# EAGLE design iotst (EAGLE 6.6.0)

## Sheet 1 of 3
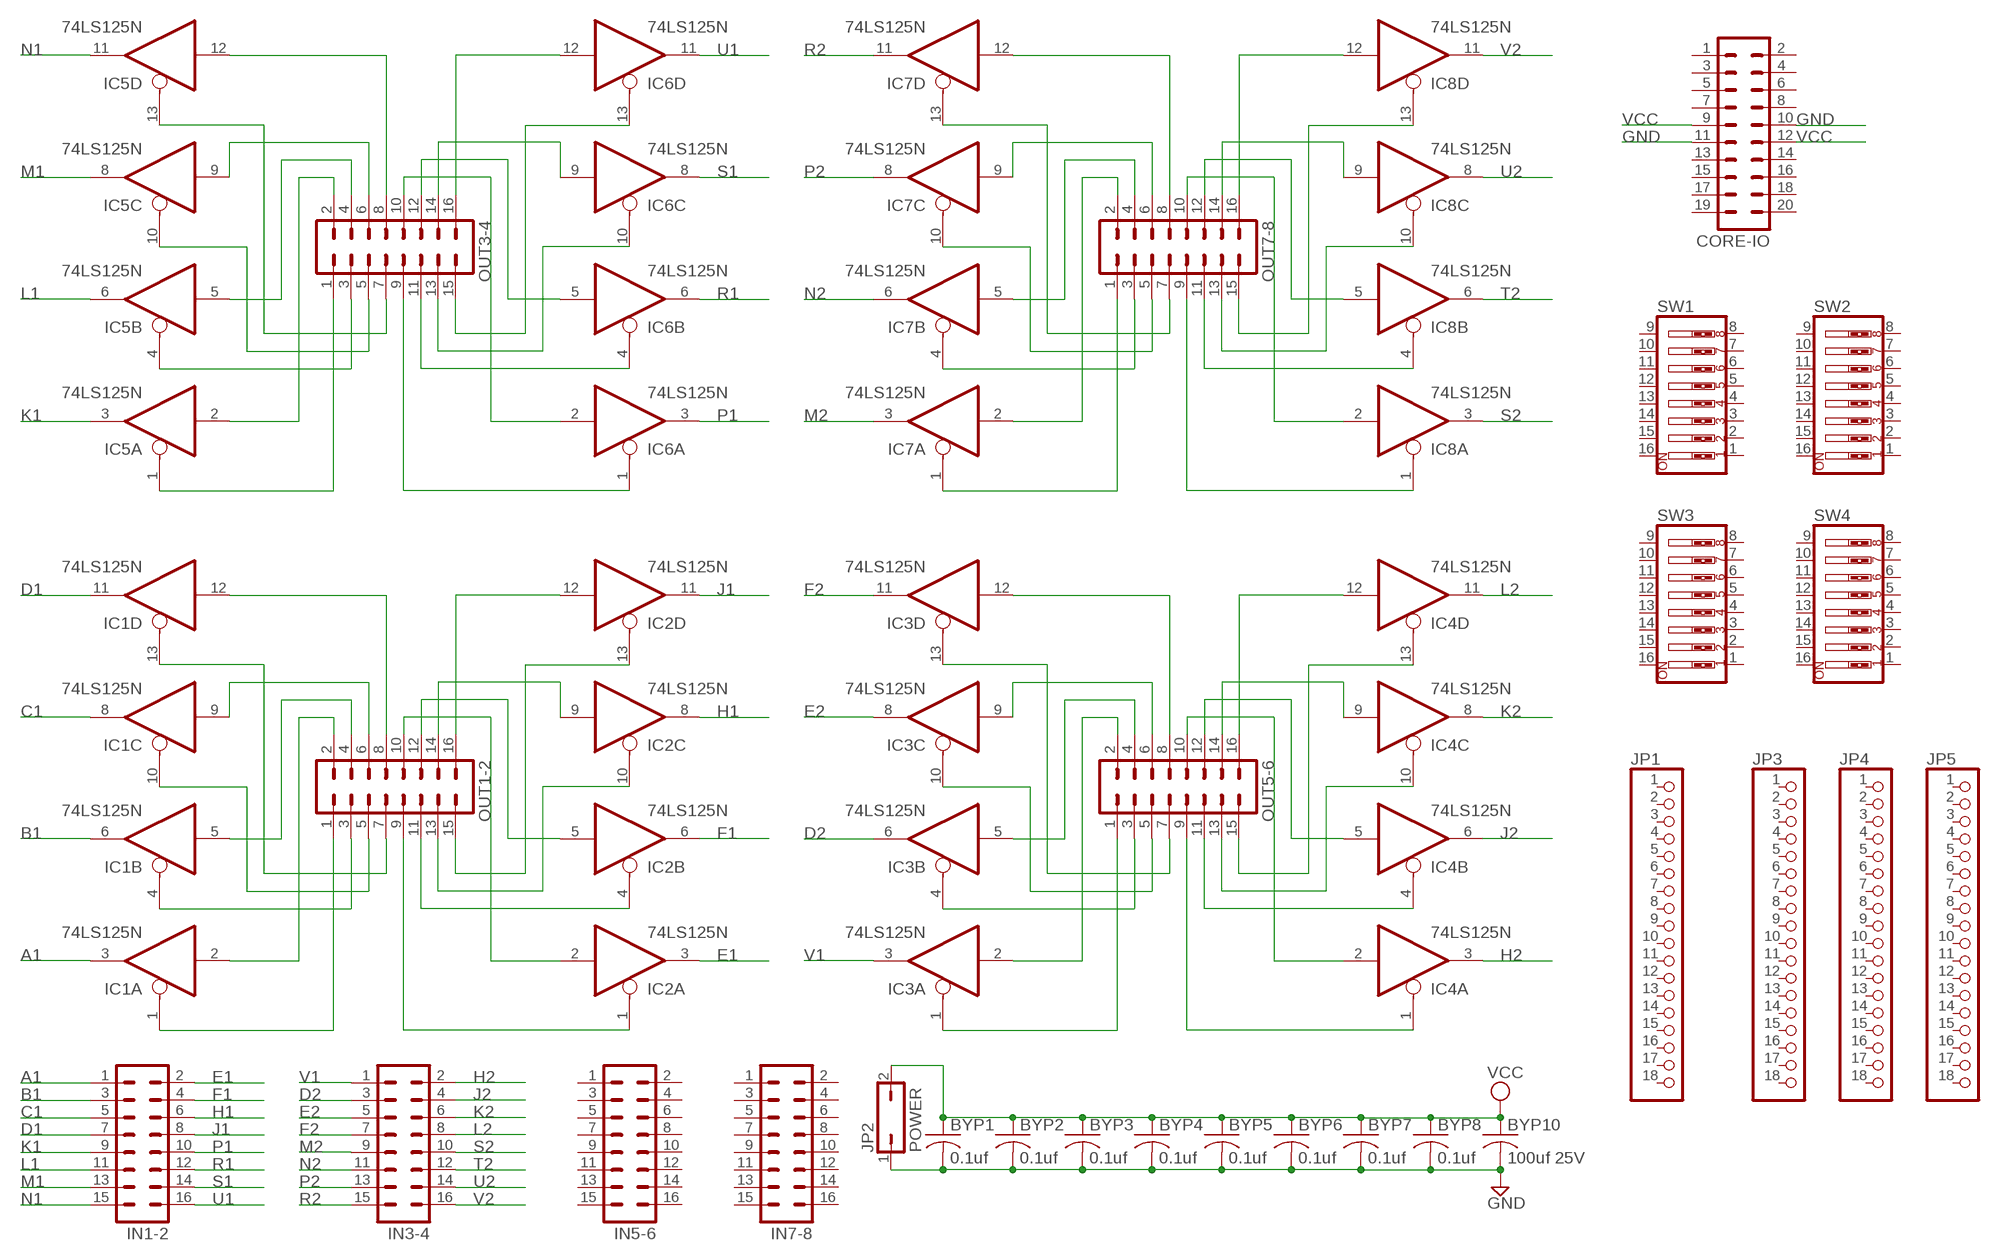
[diagram p0: schematic, sheet 1]

### Parts
BYP1  0.1uf  C-US050-025X075  [C050-025X075]
BYP2  0.1uf  C-US050-025X075  [C050-025X075]
BYP3  0.1uf  C-US050-025X075  [C050-025X075]
BYP4  0.1uf  C-US050-025X075  [C050-025X075]
BYP5  0.1uf  C-US050-025X075  [C050-025X075]
BYP6  0.1uf  C-US050-025X075  [C050-025X075]
BYP7  0.1uf  C-US050-025X075  [C050-025X075]
BYP8  0.1uf  C-US050-025X075  [C050-025X075]
BYP10  100uf 25V  C-US150-064X183  [C150-064X183]
CORE-IO  MA10-2  [MA10-2]
IC1  74LS125N  [DIL14]
IC2  74LS125N  [DIL14]
IC3  74LS125N  [DIL14]
IC4  74LS125N  [DIL14]
IC5  74LS125N  [DIL14]
IC6  74LS125N  [DIL14]
IC7  74LS125N  [DIL14]
IC8  74LS125N  [DIL14]
IN1-2  MA08-2  [MA08-2]
IN3-4  MA08-2  [MA08-2]
IN5-6  MA08-2  [MA08-2]
IN7-8  MA08-2  [MA08-2]
JP1  PINHD-1X18  [1X18]
JP2  POWER  JP1Q  [JP1]
JP3  PINHD-1X18  [1X18]
JP4  PINHD-1X18  [1X18]
JP5  PINHD-1X18  [1X18]
OUT1-2  MA08-2  [MA08-2]
OUT3-4  MA08-2  [MA08-2]
OUT5-6  MA08-2  [MA08-2]
OUT7-8  MA08-2  [MA08-2]
SW1  SW_DIP-8  [EDG-08]
SW2  SW_DIP-8  [EDG-08]
SW3  SW_DIP-8  [EDG-08]
SW4  SW_DIP-8  [EDG-08]

### Nets
A1: IC1.3(A:O) IN1-2.1 ; also sheet 3
B1: IC1.6(B:O) IN1-2.3 ; also sheet 3
C1: IC1.8(C:O) IN1-2.5 ; also sheet 3
D1: IC1.11(D:O) IN1-2.7 ; also sheet 3
D2: IC3.6(B:O) IN3-4.3 ; also sheet 3
E1: IC2.3(A:O) IN1-2.2 ; also sheet 3
E2: IC3.8(C:O) IN3-4.5 ; also sheet 3
F1: IC2.6(B:O) IN1-2.4 ; also sheet 3
F2: IC3.11(D:O) IN3-4.7 ; also sheet 3
GND [Power]: BYP1.2 BYP2.2 BYP3.2 BYP4.2 BYP5.2 BYP6.2 BYP7.2 BYP8.2 BYP10.2 CORE-IO.10 CORE-IO.11 JP2.1 ; also sheet 3
H1: IC2.8(C:O) IN1-2.6 ; also sheet 3
H2: IC4.3(A:O) IN3-4.2 ; also sheet 3
J1: IC2.11(D:O) IN1-2.8 ; also sheet 3
J2: IC4.6(B:O) IN3-4.4 ; also sheet 3
K1: IC5.3(A:O) IN1-2.9 ; also sheet 3
K2: IC4.8(C:O) IN3-4.6 ; also sheet 3
L1: IC5.6(B:O) IN1-2.11 ; also sheet 3
L2: IC4.11(D:O) IN3-4.8 ; also sheet 3
M1: IC5.8(C:O) IN1-2.13 ; also sheet 3
M2: IC7.3(A:O) IN3-4.9 ; also sheet 3
N1: IC5.11(D:O) IN1-2.15 ; also sheet 3
N2: IC7.6(B:O) IN3-4.11 ; also sheet 3
N$53: IC1.1(A:OE) OUT1-2.1
N$54: IC1.4(B:OE) OUT1-2.3
N$55: IC1.10(C:OE) OUT1-2.5
N$56: IC1.13(D:OE) OUT1-2.7
N$57: IC1.2(A:I) OUT1-2.2
N$58: IC1.5(B:I) OUT1-2.4
N$59: IC1.9(C:I) OUT1-2.6
N$60: IC1.12(D:I) OUT1-2.8
N$61: IC3.4(B:OE) OUT5-6.3
N$62: IC2.10(C:OE) OUT1-2.13
N$63: IC2.4(B:OE) OUT1-2.11
N$64: IC2.1(A:OE) OUT1-2.9
N$65: IC2.2(A:I) OUT1-2.10
N$66: IC2.5(B:I) OUT1-2.12
N$67: IC2.9(C:I) OUT1-2.14
N$68: IC2.12(D:I) OUT1-2.16
N$138: IC3.13(D:OE) OUT5-6.7
N$139: IC2.13(D:OE) OUT1-2.15
N$140: IC3.2(A:I) OUT5-6.2
N$141: IC3.5(B:I) OUT5-6.4
N$142: IC3.9(C:I) OUT5-6.6
N$143: IC3.12(D:I) OUT5-6.8
N$144: IC4.10(C:OE) OUT5-6.13
N$145: IC4.4(B:OE) OUT5-6.11
N$146: IC4.1(A:OE) OUT5-6.9
N$147: IC4.2(A:I) OUT5-6.10
N$148: IC4.9(C:I) OUT5-6.14
N$149: IC4.12(D:I) OUT5-6.16
N$150: IC3.1(A:OE) OUT5-6.1
N$151: IC3.10(C:OE) OUT5-6.5
N$152: IC4.5(B:I) OUT5-6.12
N$153: IC4.13(D:OE) OUT5-6.15
N$154: IC5.4(B:OE) OUT3-4.3
N$155: IC5.13(D:OE) OUT3-4.7
N$156: IC5.2(A:I) OUT3-4.2
N$157: IC5.5(B:I) OUT3-4.4
N$158: IC5.9(C:I) OUT3-4.6
N$159: IC5.12(D:I) OUT3-4.8
N$160: IC6.10(C:OE) OUT3-4.13
N$161: IC6.4(B:OE) OUT3-4.11
N$162: IC6.1(A:OE) OUT3-4.9
N$163: IC6.2(A:I) OUT3-4.10
N$164: IC6.9(C:I) OUT3-4.14
N$165: IC6.12(D:I) OUT3-4.16
N$166: IC5.1(A:OE) OUT3-4.1
N$167: IC5.10(C:OE) OUT3-4.5
N$168: IC6.5(B:I) OUT3-4.12
N$169: IC6.13(D:OE) OUT3-4.15
N$170: IC7.4(B:OE) OUT7-8.3
N$171: IC7.13(D:OE) OUT7-8.7
N$172: IC7.2(A:I) OUT7-8.2
N$173: IC7.5(B:I) OUT7-8.4
N$174: IC7.9(C:I) OUT7-8.6
N$175: IC7.12(D:I) OUT7-8.8
N$176: IC8.10(C:OE) OUT7-8.13
N$177: IC8.4(B:OE) OUT7-8.11
N$178: IC8.1(A:OE) OUT7-8.9
N$179: IC8.2(A:I) OUT7-8.10
N$180: IC8.9(C:I) OUT7-8.14
N$181: IC8.12(D:I) OUT7-8.16
N$182: IC7.1(A:OE) OUT7-8.1
N$183: IC7.10(C:OE) OUT7-8.5
N$184: IC8.5(B:I) OUT7-8.12
N$185: IC8.13(D:OE) OUT7-8.15
P1: IC6.3(A:O) IN1-2.10 ; also sheet 3
P2: IC7.8(C:O) IN3-4.13 ; also sheet 3
R1: IC6.6(B:O) IN1-2.12 ; also sheet 3
R2: IC7.11(D:O) IN3-4.15 ; also sheet 3
S1: IC6.8(C:O) IN1-2.14 ; also sheet 3
S2: IC8.3(A:O) IN3-4.10 ; also sheet 3
T2: IC8.6(B:O) IN3-4.12 ; also sheet 3
U1: IC6.11(D:O) IN1-2.16 ; also sheet 3
U2: IC8.8(C:O) IN3-4.14 ; also sheet 3
V1: IC3.3(A:O) IN3-4.1 ; also sheet 3
V2: IC8.11(D:O) IN3-4.16 ; also sheet 3
VCC [Power]: BYP1.1 BYP2.1 BYP3.1 BYP4.1 BYP5.1 BYP6.1 BYP7.1 BYP8.1 BYP10.1 CORE-IO.9 CORE-IO.12 JP2.2 ; also sheet 3
Unconnected: CORE-IO.1 CORE-IO.2 CORE-IO.3 CORE-IO.4 CORE-IO.5 CORE-IO.6 CORE-IO.7 CORE-IO.8 CORE-IO.13 CORE-IO.14 CORE-IO.15 CORE-IO.16 CORE-IO.17 CORE-IO.18 CORE-IO.19 CORE-IO.20 IN5-6.1 IN5-6.2 IN5-6.3 IN5-6.4 IN5-6.5 IN5-6.6 IN5-6.7 IN5-6.8 IN5-6.9 IN5-6.10 IN5-6.11 IN5-6.12 IN5-6.13 IN5-6.14 IN5-6.15 IN5-6.16 IN7-8.1 IN7-8.2 IN7-8.3 IN7-8.4 IN7-8.5 IN7-8.6 IN7-8.7 IN7-8.8 IN7-8.9 IN7-8.10 IN7-8.11 IN7-8.12 IN7-8.13 IN7-8.14 IN7-8.15 IN7-8.16 JP1.1 JP1.2 JP1.3 JP1.4 JP1.5 JP1.6 JP1.7 JP1.8 JP1.9 JP1.10 JP1.11 JP1.12 JP1.13 JP1.14 JP1.15 JP1.16 JP1.17 JP1.18 JP3.1 JP3.2 JP3.3 JP3.4 JP3.5 JP3.6 JP3.7 JP3.8 JP3.9 JP3.10 JP3.11 JP3.12 JP3.13 JP3.14 JP3.15 JP3.16 JP3.17 JP3.18 JP4.1 JP4.2 JP4.3 JP4.4 JP4.5 JP4.6 JP4.7 JP4.8 JP4.9 JP4.10 JP4.11 JP4.12 JP4.13 JP4.14 JP4.15 JP4.16 JP4.17 JP4.18 JP5.1 JP5.2 JP5.3 JP5.4 JP5.5 JP5.6 JP5.7 JP5.8 JP5.9 JP5.10 JP5.11 JP5.12 JP5.13 JP5.14 JP5.15 JP5.16 JP5.17 JP5.18 SW1.1 SW1.2 SW1.3 SW1.4 SW1.5 SW1.6 SW1.7 SW1.8 SW1.9 SW1.10 SW1.11 SW1.12 SW1.13 SW1.14 SW1.15 SW1.16 SW2.1 SW2.2 SW2.3 SW2.4 SW2.5 SW2.6 SW2.7 SW2.8 SW2.9 SW2.10 SW2.11 SW2.12 SW2.13 SW2.14 SW2.15 SW2.16 SW3.1 SW3.2 SW3.3 SW3.4 SW3.5 SW3.6 SW3.7 SW3.8 SW3.9 SW3.10 SW3.11 SW3.12 SW3.13 SW3.14 SW3.15 SW3.16 SW4.1 SW4.2 SW4.3 SW4.4 SW4.5 SW4.6 SW4.7 SW4.8 SW4.9 SW4.10 SW4.11 SW4.12 SW4.13 SW4.14 SW4.15 SW4.16

## Sheet 2 of 3
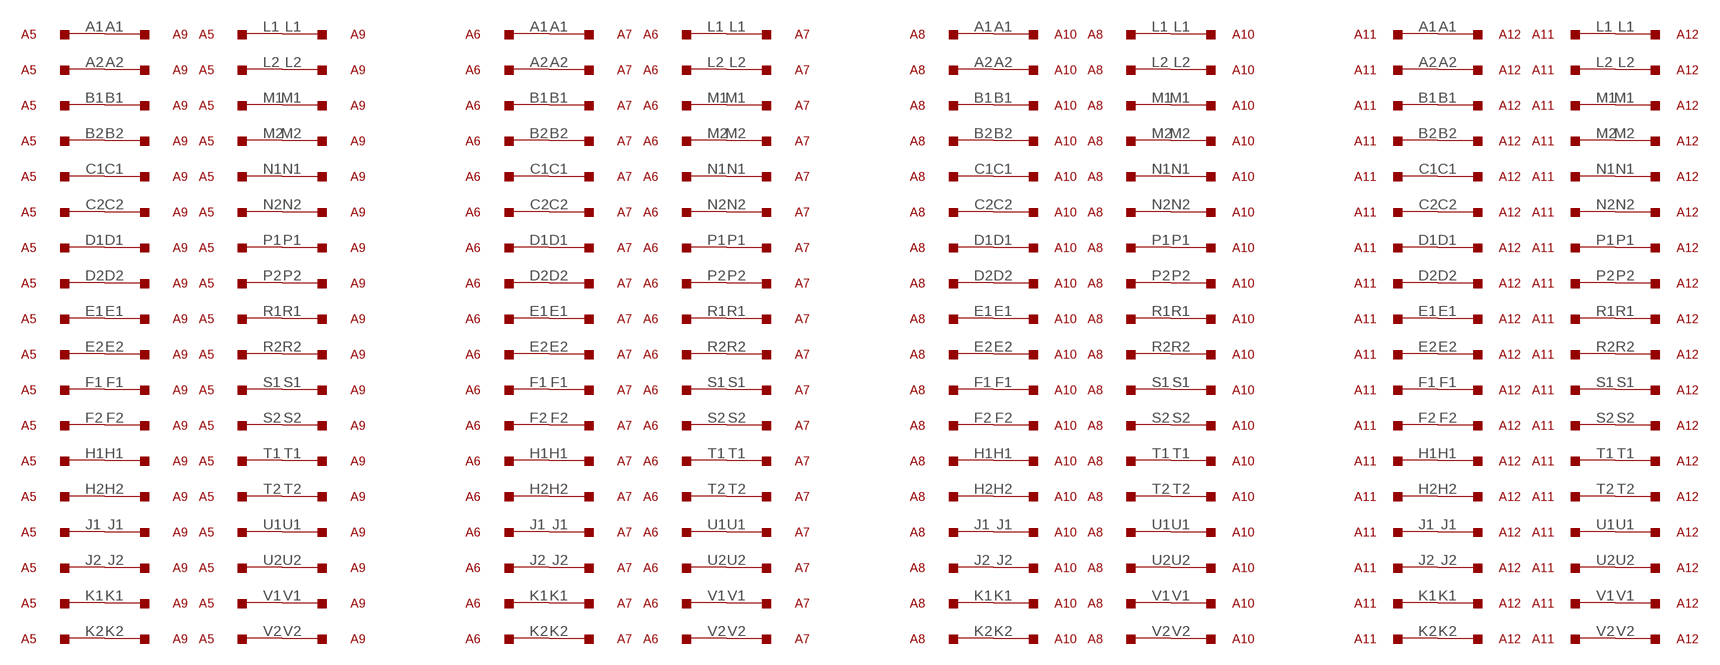
[diagram p1: schematic, sheet 2]

### Parts
A5  M916  [H807]
A6  M916  [H807]
A7  M916  [H807]
A8  M916  [H807]
A9  M916  [H807]
A10  M916  [H807]
A11  M916  [H807]
A12  M916  [H807]

### Nets
N$26: A5.L1 A9.L1
N$33: A5.L2 A9.L2
N$34: A5.M1 A9.M1
N$35: A5.M2 A9.M2
N$36: A5.N1 A9.N1
N$49: A5.N2 A9.N2
N$50: A5.P1 A9.P1
N$51: A5.P2 A9.P2
N$52: A5.R1 A9.R1
N$69: A5.R2 A9.R2
N$70: A5.S1 A9.S1
N$71: A5.S2 A9.S2
N$72: A5.T1 A9.T1
N$73: A5.T2 A9.T2
N$74: A5.U1 A9.U1
N$75: A5.U2 A9.U2
N$76: A5.V1 A9.V1
N$81: A5.V2 A9.V2
N$82: A5.A1 A9.A1
N$83: A5.A2 A9.A2
N$84: A5.B1 A9.B1
N$85: A5.B2 A9.B2
N$86: A5.C1 A9.C1
N$87: A5.C2 A9.C2
N$88: A5.D1 A9.D1
N$89: A5.D2 A9.D2
N$90: A5.E1 A9.E1
N$91: A5.E2 A9.E2
N$92: A5.F1 A9.F1
N$93: A5.F2 A9.F2
N$95: A5.H1 A9.H1
N$96: A5.H2 A9.H2
N$97: A5.J1 A9.J1
N$98: A5.J2 A9.J2
N$99: A5.K1 A9.K1
N$100: A5.K2 A9.K2
N$113: A6.L1 A7.L1
N$114: A6.L2 A7.L2
N$115: A6.M1 A7.M1
N$116: A6.M2 A7.M2
N$117: A6.N1 A7.N1
N$118: A6.N2 A7.N2
N$119: A6.P1 A7.P1
N$120: A6.P2 A7.P2
N$121: A6.R1 A7.R1
N$122: A6.R2 A7.R2
N$123: A6.S1 A7.S1
N$137: A6.S2 A7.S2
N$186: A6.T1 A7.T1
N$187: A6.T2 A7.T2
N$188: A6.U1 A7.U1
N$189: A6.U2 A7.U2
N$190: A6.V1 A7.V1
N$191: A6.V2 A7.V2
N$192: A6.A1 A7.A1
N$193: A6.A2 A7.A2
N$194: A6.B1 A7.B1
N$195: A6.B2 A7.B2
N$196: A6.C1 A7.C1
N$197: A6.C2 A7.C2
N$198: A6.D1 A7.D1
N$199: A6.D2 A7.D2
N$200: A6.E1 A7.E1
N$201: A6.E2 A7.E2
N$202: A6.F1 A7.F1
N$203: A6.F2 A7.F2
N$204: A6.H1 A7.H1
N$205: A6.H2 A7.H2
N$206: A6.J1 A7.J1
N$207: A6.J2 A7.J2
N$208: A6.K1 A7.K1
N$209: A6.K2 A7.K2
N$210: A8.L1 A10.L1
N$211: A8.L2 A10.L2
N$212: A8.M1 A10.M1
N$213: A8.M2 A10.M2
N$214: A8.N1 A10.N1
N$215: A8.N2 A10.N2
N$216: A8.P1 A10.P1
N$217: A8.P2 A10.P2
N$218: A8.R1 A10.R1
N$219: A8.R2 A10.R2
N$220: A8.S1 A10.S1
N$221: A8.S2 A10.S2
N$222: A8.T1 A10.T1
N$223: A8.T2 A10.T2
N$224: A8.U1 A10.U1
N$225: A8.U2 A10.U2
N$226: A8.V1 A10.V1
N$227: A8.V2 A10.V2
N$228: A8.A1 A10.A1
N$229: A8.A2 A10.A2
N$230: A8.B1 A10.B1
N$231: A8.B2 A10.B2
N$232: A8.C1 A10.C1
N$233: A8.C2 A10.C2
N$234: A8.D1 A10.D1
N$235: A8.D2 A10.D2
N$236: A8.E1 A10.E1
N$237: A8.E2 A10.E2
N$238: A8.F1 A10.F1
N$239: A8.F2 A10.F2
N$240: A8.H1 A10.H1
N$241: A8.H2 A10.H2
N$242: A8.J1 A10.J1
N$243: A8.J2 A10.J2
N$244: A8.K1 A10.K1
N$245: A8.K2 A10.K2
N$246: A11.L1 A12.L1
N$247: A11.L2 A12.L2
N$248: A11.M1 A12.M1
N$249: A11.M2 A12.M2
N$250: A11.N1 A12.N1
N$251: A11.N2 A12.N2
N$252: A11.P1 A12.P1
N$253: A11.P2 A12.P2
N$254: A11.R1 A12.R1
N$255: A11.R2 A12.R2
N$256: A11.S1 A12.S1
N$257: A11.S2 A12.S2
N$258: A11.T1 A12.T1
N$259: A11.T2 A12.T2
N$260: A11.U1 A12.U1
N$261: A11.U2 A12.U2
N$262: A11.V1 A12.V1
N$263: A11.V2 A12.V2
N$264: A11.A1 A12.A1
N$265: A11.A2 A12.A2
N$266: A11.B1 A12.B1
N$267: A11.B2 A12.B2
N$268: A11.C1 A12.C1
N$269: A11.C2 A12.C2
N$270: A11.D1 A12.D1
N$271: A11.D2 A12.D2
N$272: A11.E1 A12.E1
N$273: A11.E2 A12.E2
N$274: A11.F1 A12.F1
N$275: A11.F2 A12.F2
N$276: A11.H1 A12.H1
N$277: A11.H2 A12.H2
N$278: A11.J1 A12.J1
N$279: A11.J2 A12.J2
N$280: A11.K1 A12.K1
N$281: A11.K2 A12.K2

## Sheet 3 of 3
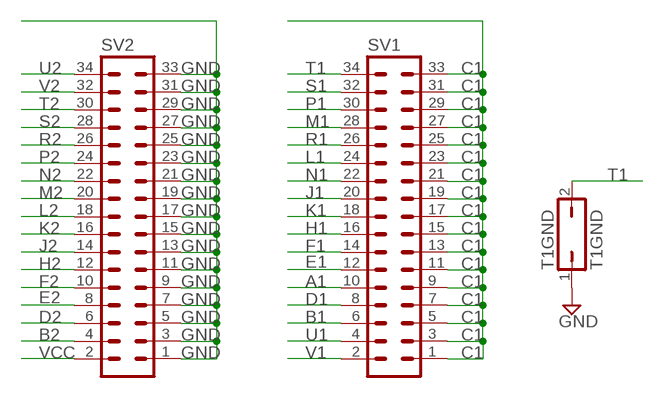
[diagram p2: schematic, sheet 3]

### Parts
SV1  MA17-2  [MA17-2]
SV2  MA17-2  [MA17-2]
T1GND  T1GND  JP1Q  [JP1]

### Nets
A1: SV1.10 ; also sheet 1
B1: SV1.6 ; also sheet 1
B2: SV2.4
C1: SV1.1 SV1.3 SV1.5 SV1.7 SV1.9 SV1.11 SV1.13 SV1.15 SV1.17 SV1.19 SV1.21 SV1.23 SV1.25 SV1.27 SV1.29 SV1.31 SV1.33 ; also sheet 1
D1: SV1.8 ; also sheet 1
D2: SV2.6 ; also sheet 1
E1: SV1.12 ; also sheet 1
E2: SV2.8 ; also sheet 1
F1: SV1.14 ; also sheet 1
F2: SV2.10 ; also sheet 1
GND [Power]: SV2.1 SV2.3 SV2.5 SV2.7 SV2.9 SV2.11 SV2.13 SV2.15 SV2.17 SV2.19 SV2.21 SV2.23 SV2.25 SV2.27 SV2.29 SV2.31 SV2.33 T1GND.1 ; also sheet 1
H1: SV1.16 ; also sheet 1
H2: SV2.12 ; also sheet 1
J1: SV1.20 ; also sheet 1
J2: SV2.14 ; also sheet 1
K1: SV1.18 ; also sheet 1
K2: SV2.16 ; also sheet 1
L1: SV1.24 ; also sheet 1
L2: SV2.18 ; also sheet 1
M1: SV1.28 ; also sheet 1
M2: SV2.20 ; also sheet 1
N1: SV1.22 ; also sheet 1
N2: SV2.22 ; also sheet 1
P1: SV1.30 ; also sheet 1
P2: SV2.24 ; also sheet 1
R1: SV1.26 ; also sheet 1
R2: SV2.26 ; also sheet 1
S1: SV1.32 ; also sheet 1
S2: SV2.28 ; also sheet 1
T1: SV1.34 T1GND.2
T2: SV2.30 ; also sheet 1
U1: SV1.4 ; also sheet 1
U2: SV2.34 ; also sheet 1
V1: SV1.2 ; also sheet 1
V2: SV2.32 ; also sheet 1
VCC [Power]: SV2.2 ; also sheet 1

## Power pins joined to a net without a drawn wire
GND: IC1.7(P:GND) IC2.7(P:GND) IC3.7(P:GND) IC4.7(P:GND) IC5.7(P:GND) IC6.7(P:GND) IC7.7(P:GND) IC8.7(P:GND)
VCC: IC1.14(P:VCC) IC2.14(P:VCC) IC3.14(P:VCC) IC4.14(P:VCC) IC5.14(P:VCC) IC6.14(P:VCC) IC7.14(P:VCC) IC8.14(P:VCC)

## Library data of the parts
A5-A12 = dec-m:M916: Simple 36 pin connector/wire cable
BYP1-BYP8 BYP10 = rcl:C-US: CAPACITOR, American symbol
CORE-IO = con-lstb:MA10-2: PIN HEADER; OC_FARNELL: unknown; OC_NEWARK: unknown
IC1-IC8 = 74xx-us:74*125: Quad bus BUFFER, 3-state
IN1-2 IN3-4 IN5-6 IN7-8 OUT1-2 OUT3-4 OUT5-6 OUT7-8 = con-lstb:MA08-2: PIN HEADER; OC_FARNELL: unknown; OC_NEWARK: unknown
JP1 JP3-JP5 = pinhead:PINHD-1X18: PIN HEADER
JP2 T1GND = jumper:JP1Q: JUMPER
SV1 SV2 = con-lstb:MA17-2: PIN HEADER; OC_FARNELL: unknown; OC_NEWARK: unknown
SW1-SW4 = special:SW_DIP-8: DIP SWITCH

## Net classes
1 Power: width 0.508 mm, drill 0.254 mm, clearance 0.254 mm

## Board
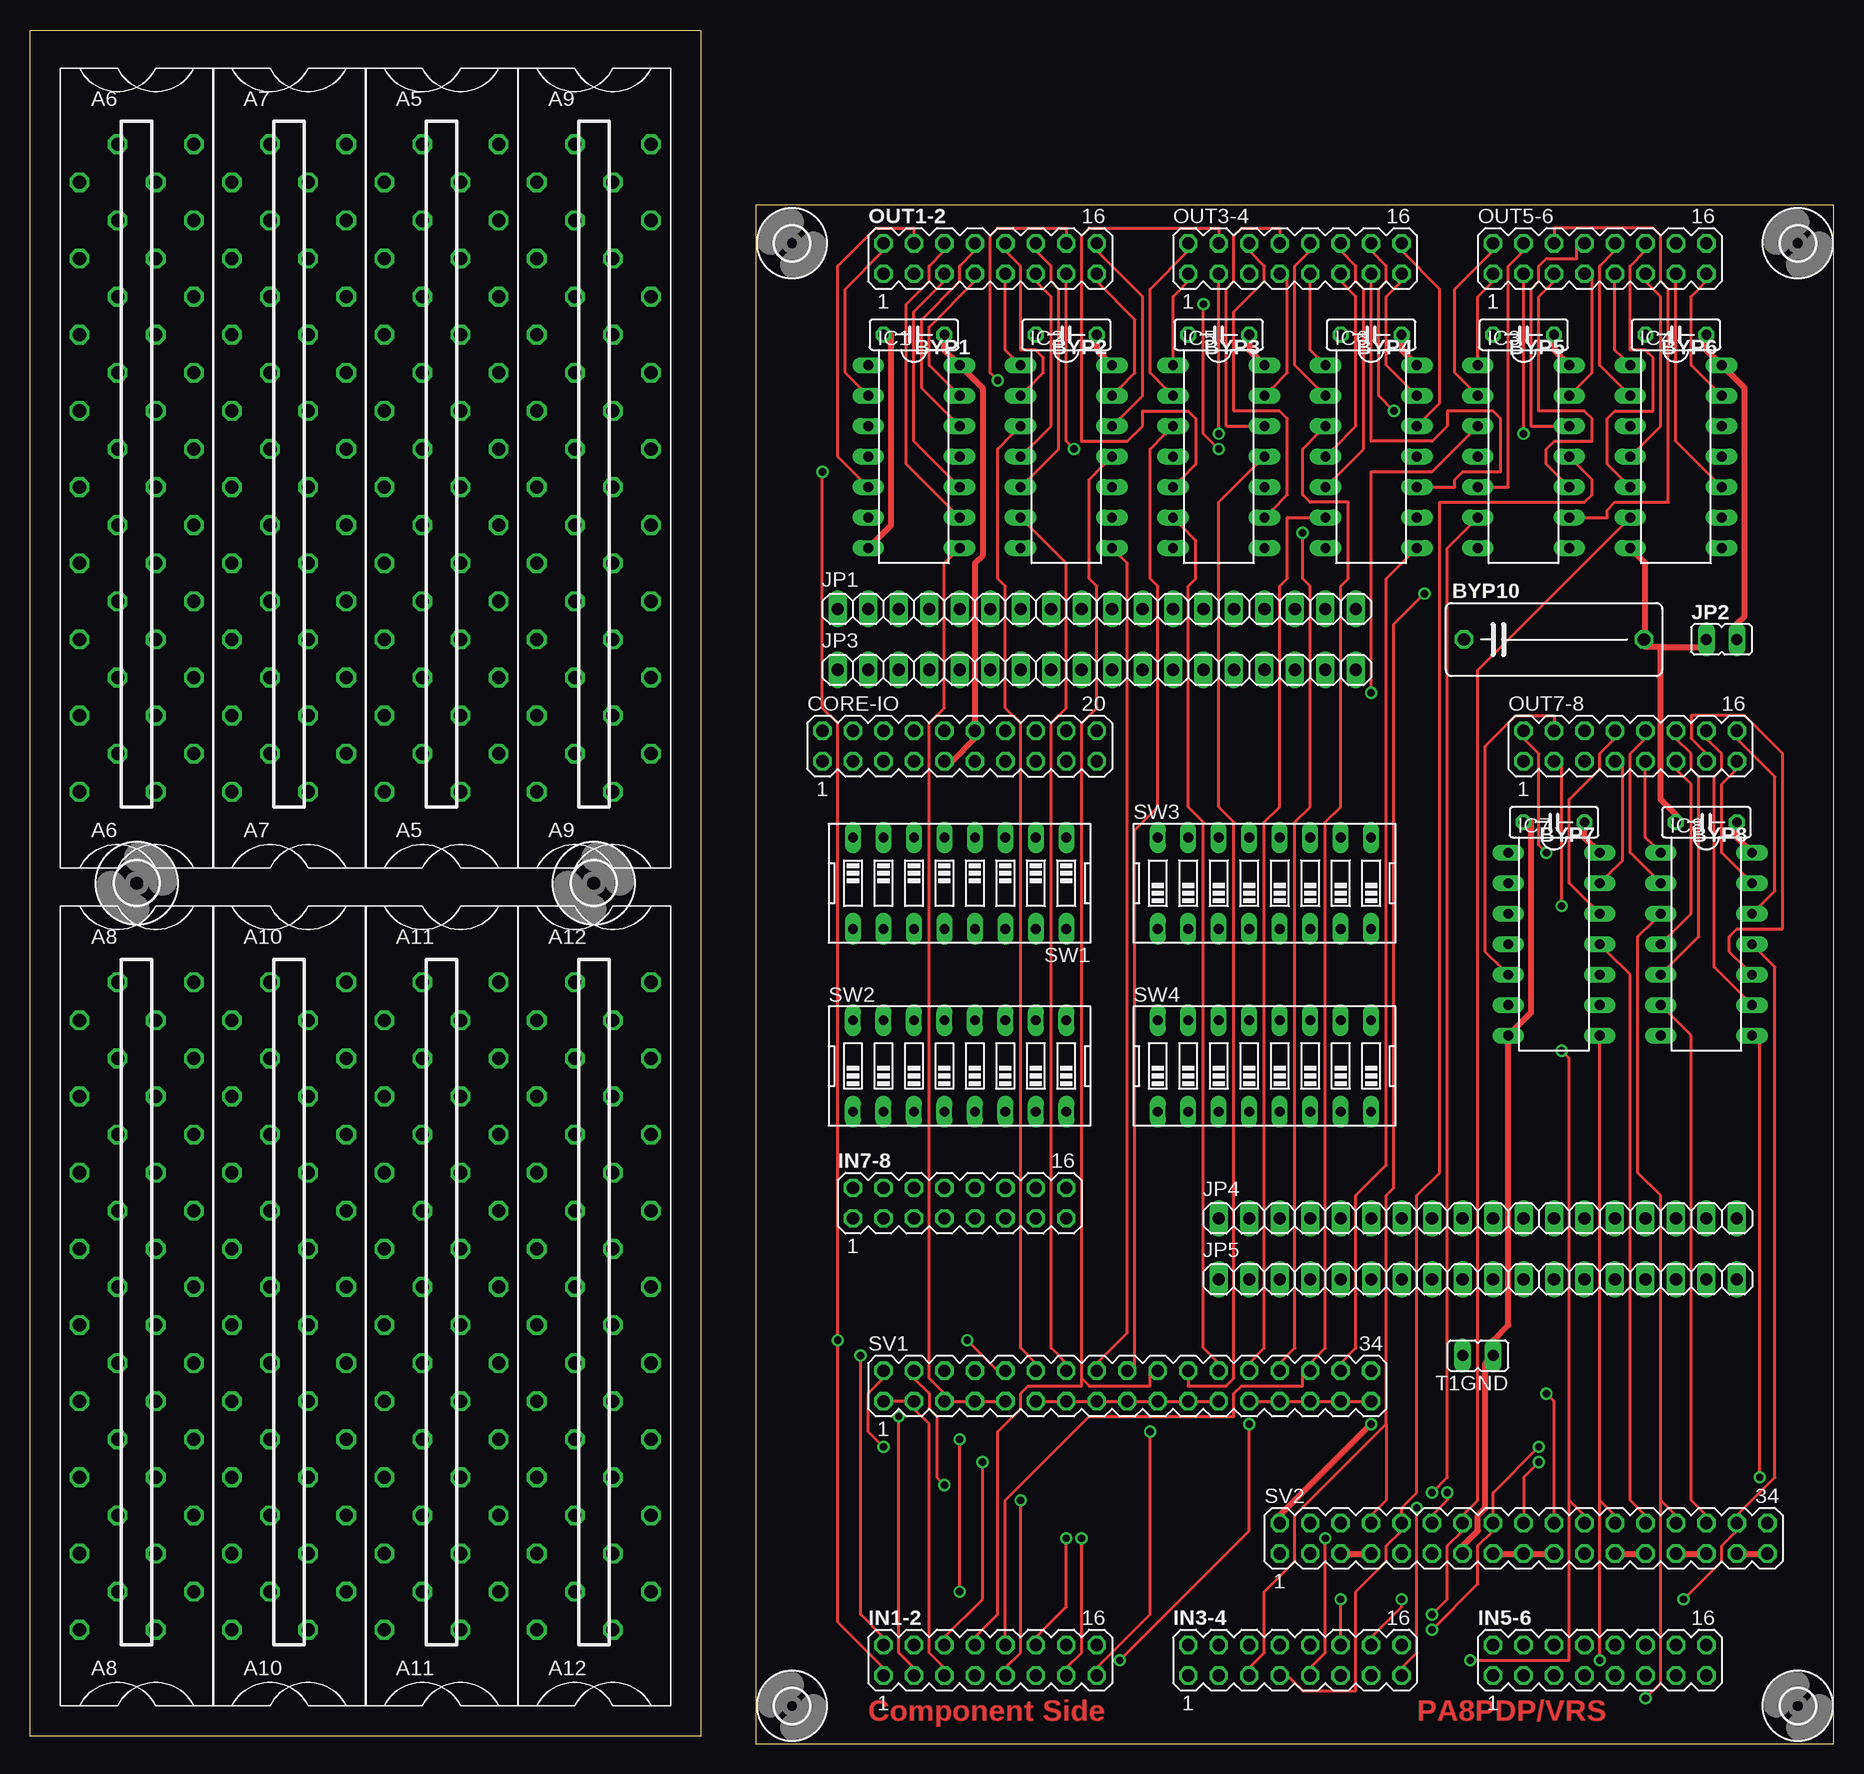
[diagram p3: board, top side]
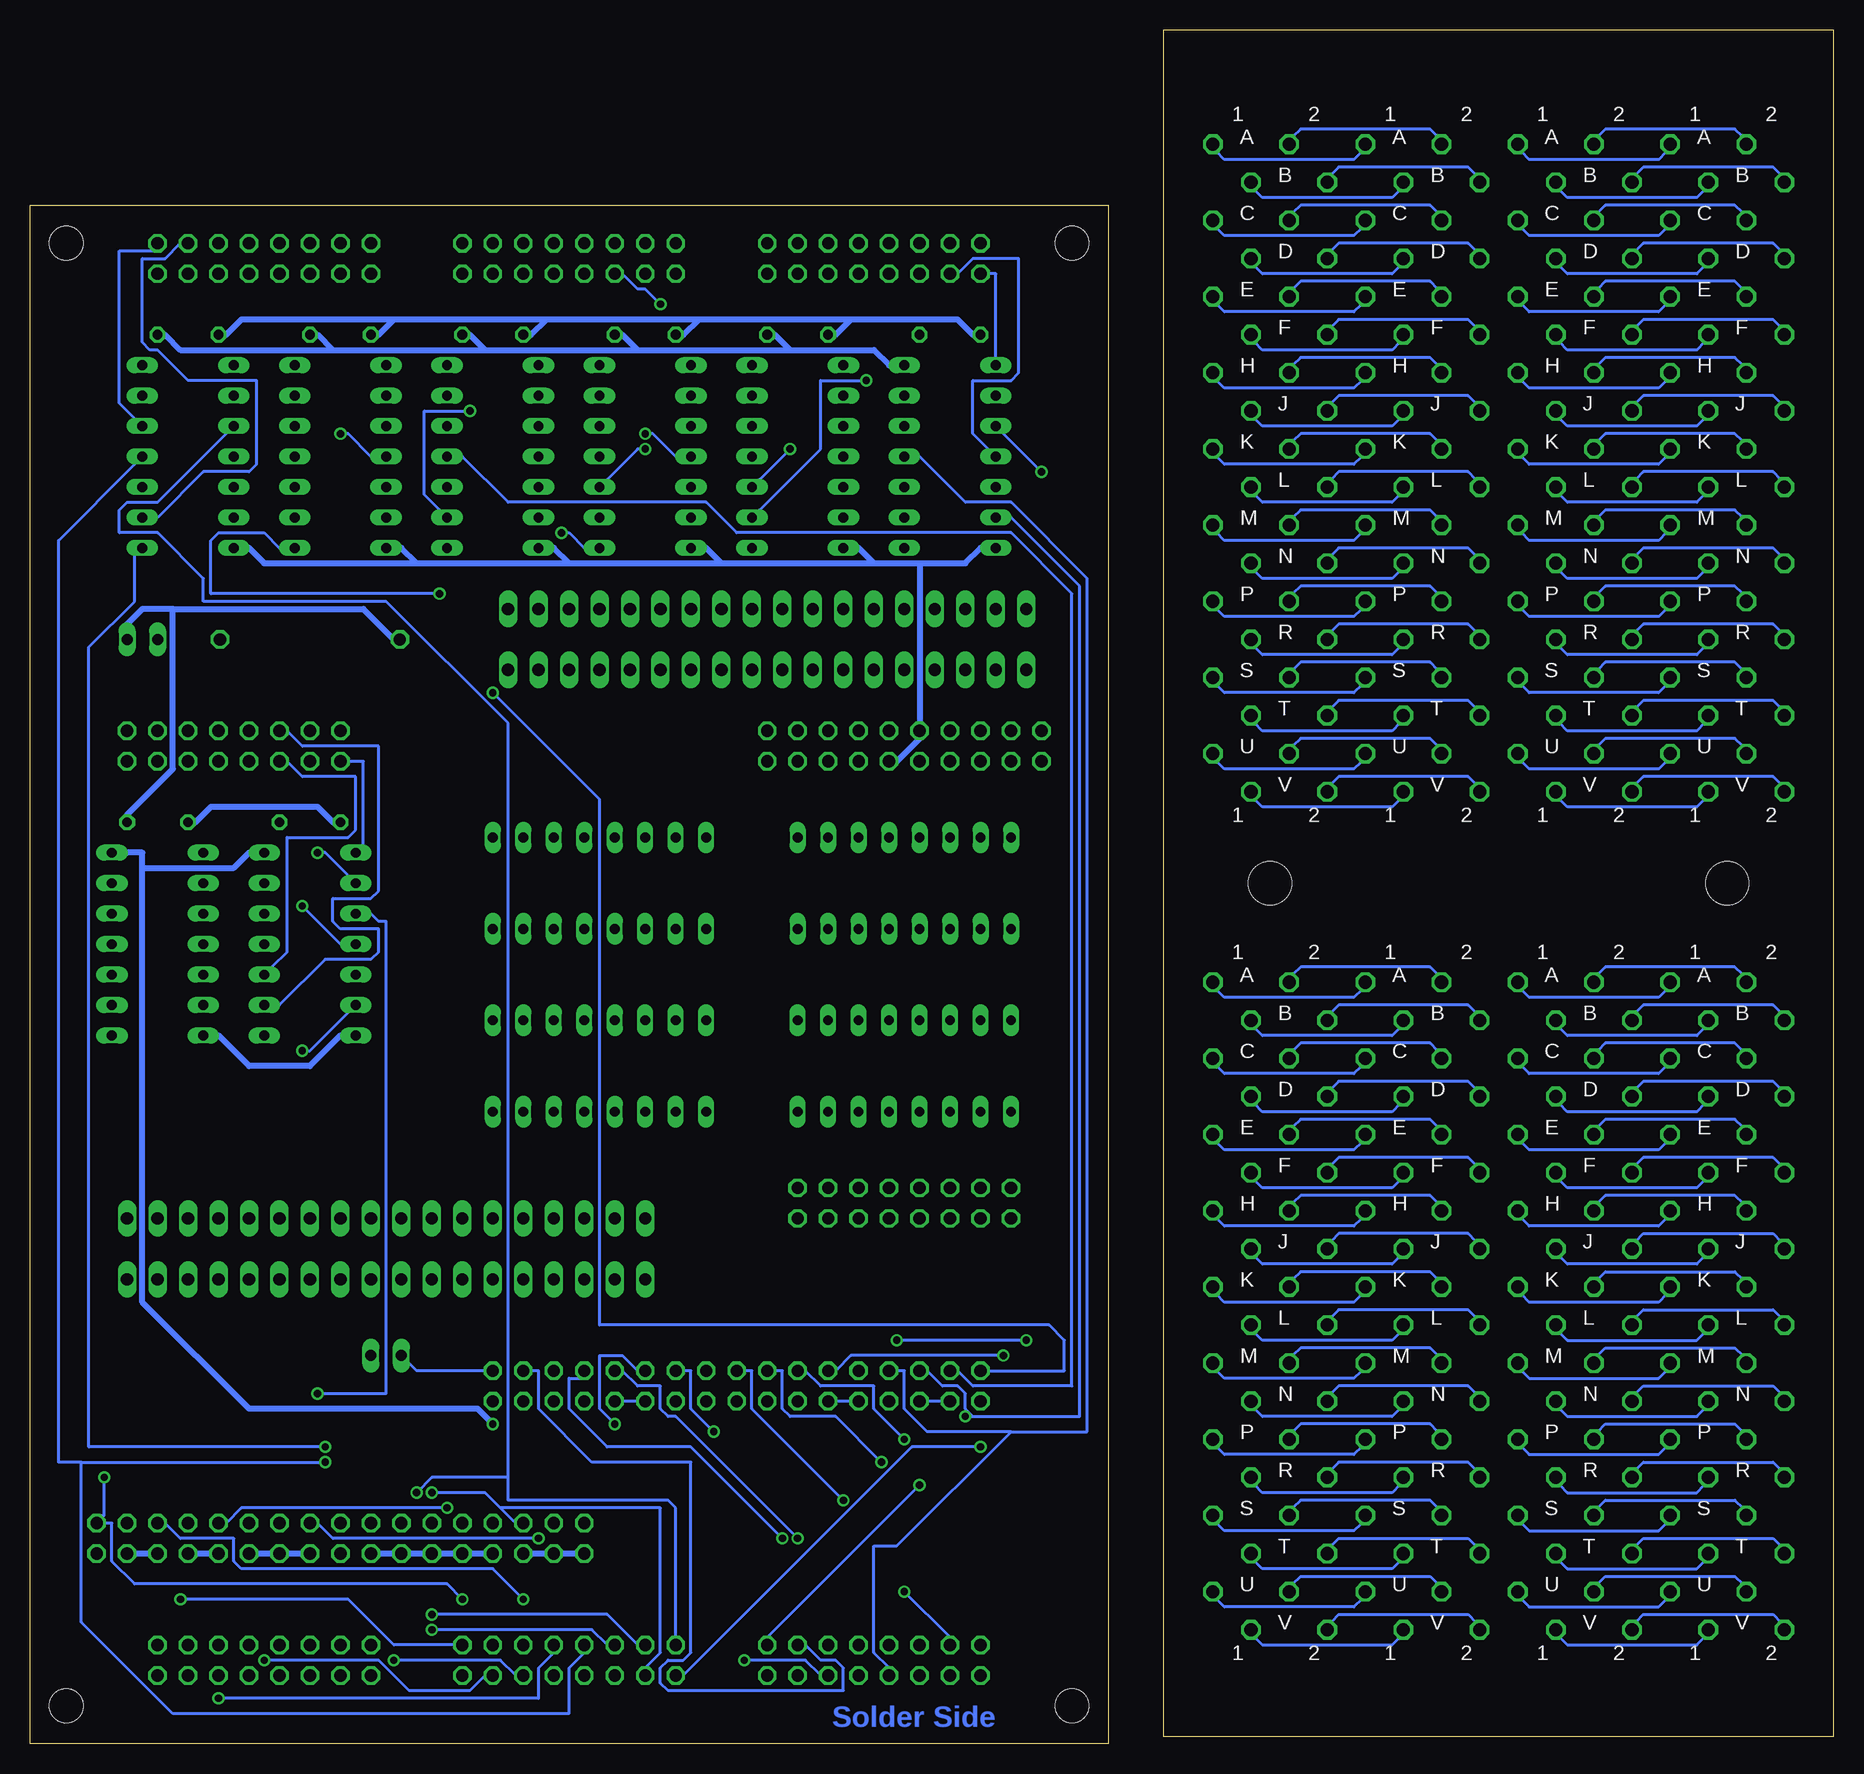
[diagram p4: board, bottom side, seen from below]

Size 150.33 x 142.86 mm. Coordinates in mm from the lower left corner, seen from the top.
Outline: 60.49,128.25 60.49,0 150.33,0 150.33,128.25 60.49,128.25
Outline: 55.88,0.62 0,0.62 0,142.86 55.88,142.86 55.88,0.62
Copper layers (1*16): Top 0.035mm / dielectric 1.5mm / Bottom 0.035mm
Design rules "olimex10mil": minimum track width 10mil, minimum drill 24mil, track to track 10mil, track to pad 10mil, pad to pad 10mil, via to via 10mil, smd to smd 10mil, copper to edge 40mil, drill to drill 10mil, minimum pad ring 10mil, minimum via ring 8mil, stop-mask expansion 0mil, vias tented up to drill 0mil, thermal gap 10mil

### Footprints (pad centres in the part's own frame; a part is rotated, then mirrored left to right if it is on the bottom)
H807 = drill 1.092 octagon: A1 4.763,28.575; A2 -1.587,28.575; B1 1.587,25.4; B2 -4.763,25.4; C1 4.763,22.225; C2 -1.587,22.225; D1 1.587,19.05; D2 -4.763,19.05; E1 4.763,15.875; E2 -1.587,15.875; F1 1.587,12.7; F2 -4.763,12.7; H1 4.763,9.525; H2 -1.587,9.525; J1 1.587,6.35; J2 -4.763,6.35; K1 4.763,3.175; K2 -1.587,3.175; L1 1.587,0; L2 -4.763,0; M1 4.763,-3.175; M2 -1.587,-3.175; N1 1.587,-6.35; N2 -4.763,-6.35; P1 4.763,-9.525; P2 -1.587,-9.525; R1 1.587,-12.7; R2 -4.763,-12.7; S1 4.763,-15.875; S2 -1.587,-15.875; T1 1.587,-19.05; T2 -4.763,-19.05; U1 4.763,-22.225; U2 -1.587,-22.225; V1 1.587,-25.4; V2 -4.763,-25.4
C050-025X075 = drill 0.813 octagon: 1 -2.54,0; 2 2.54,0
C150-064X183 = drill 1.016 octagon: 1 -7.493,0; 2 7.493,0
MA10-2 = drill 1.016 octagon: 1 -11.43,-1.27; 2 -11.43,1.27; 3 -8.89,-1.27; 4 -8.89,1.27; 5 -6.35,-1.27; 6 -6.35,1.27; 7 -3.81,-1.27; 8 -3.81,1.27; 9 -1.27,-1.27; 10 -1.27,1.27; 11 1.27,-1.27; 12 1.27,1.27; 13 3.81,-1.27; 14 3.81,1.27; 15 6.35,-1.27; 16 6.35,1.27; 17 8.89,-1.27; 18 8.89,1.27; 19 11.43,-1.27; 20 11.43,1.27
DIL14 = drill 0.813 long: 1 -7.62,-3.81; 2 -5.08,-3.81; 3 -2.54,-3.81; 4 0,-3.81; 5 2.54,-3.81; 6 5.08,-3.81; 7 7.62,-3.81; 8 7.62,3.81; 9 5.08,3.81; 10 2.54,3.81; 11 0,3.81; 12 -2.54,3.81; 13 -5.08,3.81; 14 -7.62,3.81
MA08-2 = drill 1.016 octagon: 1 -8.89,-1.27; 2 -8.89,1.27; 3 -6.35,-1.27; 4 -6.35,1.27; 5 -3.81,-1.27; 6 -3.81,1.27; 7 -1.27,-1.27; 8 -1.27,1.27; 9 1.27,-1.27; 10 1.27,1.27; 11 3.81,-1.27; 12 3.81,1.27; 13 6.35,-1.27; 14 6.35,1.27; 15 8.89,-1.27; 16 8.89,1.27
1X18 = drill 1.016 long: 1 -21.59,0; 2 -19.05,0; 3 -16.51,0; 4 -13.97,0; 5 -11.43,0; 6 -8.89,0; 7 -6.35,0; 8 -3.81,0; 9 -1.27,0; 10 1.27,0; 11 3.81,0; 12 6.35,0; 13 8.89,0; 14 11.43,0; 15 13.97,0; 16 16.51,0; 17 19.05,0; 18 21.59,0
JP1 = drill 0.914 long: 1 0,-1.27; 2 0,1.27
MA17-2 = drill 1.016 octagon: 1 -20.32,-1.27; 2 -20.32,1.27; 3 -17.78,-1.27; 4 -17.78,1.27; 5 -15.24,-1.27; 6 -15.24,1.27; 7 -12.7,-1.27; 8 -12.7,1.27; 9 -10.16,-1.27; 10 -10.16,1.27; 11 -7.62,-1.27; 12 -7.62,1.27; 13 -5.08,-1.27; 14 -5.08,1.27; 15 -2.54,-1.27; 16 -2.54,1.27; 17 0,-1.27; 18 0,1.27; 19 2.54,-1.27; 20 2.54,1.27; 21 5.08,-1.27; 22 5.08,1.27; 23 7.62,-1.27; 24 7.62,1.27; 25 10.16,-1.27; 26 10.16,1.27; 27 12.7,-1.27; 28 12.7,1.27; 29 15.24,-1.27; 30 15.24,1.27; 31 17.78,-1.27; 32 17.78,1.27; 33 20.32,-1.27; 34 20.32,1.27
EDG-08 = drill 0.813 long: 1 -8.89,-3.81; 2 -6.35,-3.81; 3 -3.81,-3.81; 4 -1.27,-3.81; 5 1.27,-3.81; 6 3.81,-3.81; 7 6.35,-3.81; 8 8.89,-3.81; 9 8.89,3.81; 10 6.35,3.81; 11 3.81,3.81; 12 1.27,3.81; 13 -1.27,3.81; 14 -3.81,3.81; 15 -6.35,3.81; 16 -8.89,3.81
2,8 = hole 2.8: 0,0
3,6 = hole 3.6: 0,0

### Placement (x,y rotation side)
A5  34.29,104.76 0 top
A6  8.89,104.76 0 top
A7  21.59,104.76 0 top
A8  8.89,34.91 0 top
A9  46.99,104.76 0 top
A10  21.59,34.91 0 top
A11  34.29,34.91 0 top
A12  46.99,34.91 0 top
BYP1  73.66,117.46 180 top
BYP2  86.36,117.46 180 top
BYP3  99.06,117.46 180 top
BYP4  111.76,117.46 180 top
BYP5  124.46,117.46 180 top
BYP6  137.16,117.46 180 top
BYP7  127,76.82 180 top
BYP8  139.7,76.82 180 top
BYP10  127,92.06 0 top
CORE-IO  77.47,83.17 0 top
IC1  73.66,107.3 270 top
IC2  86.36,107.3 270 top
IC3  124.46,107.3 270 top
IC4  137.16,107.3 270 top
IC5  99.06,107.3 270 top
IC6  111.76,107.3 270 top
IC7  127,66.66 270 top
IC8  139.7,66.66 270 top
IN1-2  80.01,6.97 0 top
IN3-4  105.41,6.97 0 top
IN5-6  130.81,6.97 0 top
IN7-8  77.47,45.07 0 top
JP1  88.9,94.6 0 top
JP2  140.97,92.06 270 top
JP3  88.9,89.52 0 top
JP4  120.65,43.8 0 top
JP5  120.65,38.72 0 top
OUT1-2  80.01,123.81 0 top
OUT3-4  105.41,123.81 0 top
OUT5-6  130.81,123.81 0 top
OUT7-8  133.35,83.17 0 top
SV1  91.44,29.83 0 top
SV2  124.46,17.13 0 top
SW1  77.47,71.74 180 top
SW2  77.47,56.5 0 top
SW3  102.87,71.74 0 top
SW4  102.87,56.5 0 top
T1GND  120.65,32.37 90 top
U$1  [2,8]  63.5,3.16 270 top
U$2  [2,8]  147.32,3.16 270 top
U$3  [2,8]  147.32,125.08 270 top
U$4  [2,8]  63.5,125.08 270 top
U$5  [3,6]  8.89,71.74 0 top
U$6  [3,6]  46.99,71.74 0 top

### Tracks (layer width: path | path; a pad name or v marks a point on that pad's centre or on a via)
A1  (via drill 0.61)
  Top 0.254: v66.04,106.03 66.04,86.35 67.31,85.08 v67.31,33.64 67.31,10.14 71.12,6.33 IN1-2.1 | v78.11,33.64 80.65,31.1 SV1.10
  Bottom 0.254: v66.04,106.03 69.22,109.21 IC1.3 | v67.31,33.64 v78.11,33.64
B1  (via drill 0.61)
  Top 0.254: v72.39,27.29 72.39,7.6 73.66,6.33 IN1-2.3
  Bottom 0.254: 71.75,27.29 62.87,27.29 62.87,96.51 68.58,102.22 IC1.6 | 71.75,27.29 72.39,27.92 72.39,29.2 73.03,29.83 74.3,29.83 75.56,31.1 SV1.6 | v72.39,27.29 71.75,27.29
C1
  Top 0.254: SV1.1 71.75,28.56 73.03,28.56 SV1.3 73.66,27.92 74.93,26.65 74.93,7.6 76.2,6.33 IN1-2.5 | IC1.8 76.84,99.05 76.2,98.41 76.2,86.35 74.93,85.08 74.93,30.46 76.2,29.2 SV1.5 76.84,28.56 78.11,28.56 SV1.7 79.38,28.56 80.65,28.56 SV1.9 | SV1.11 84.45,28.56 85.72,28.56 SV1.13 87,28.56 88.27,28.56 SV1.15 89.53,28.56 90.81,28.56 SV1.17 92.08,28.56 93.34,28.56 SV1.19 94.62,28.56 95.89,28.56 SV1.21 97.16,28.56 98.43,28.56 SV1.23 | SV1.25 102.23,28.56 103.5,28.56 SV1.27 104.78,28.56 106.05,28.56 SV1.29 107.31,28.56 108.59,28.56 SV1.31 109.86,28.56 111.12,28.56 SV1.33
  Bottom 0.254: SV1.11 83.19,28.56 81.92,28.56 SV1.9 | SV1.25 100.97,28.56 99.69,28.56 SV1.23 | SV1.3 74.3,28.56 75.56,28.56 SV1.5
D1
  Bottom 0.254: 68.58,26.02 75.56,26.02 77.47,27.92 77.47,31.1 78.11,31.1 SV1.8 | 68.58,26.02 62.23,26.02 62.23,97.14 68.58,103.49 72.39,103.49 76.2,107.3 IC1.11 | 68.58,26.02 78.11,16.49 80.01,16.49 80.01,7.6 78.74,6.33 IN1-2.7
D2  (via drill 0.61)
  Top 0.254: v116.84,20.94 118.11,22.21 118.11,99.68 120.02,101.59 IC3.6
  Bottom 0.254: v116.84,20.94 112.4,20.94 111.12,19.67 | 111.12,19.67 109.86,18.4 SV2.6 | 111.12,19.67 97.79,19.67 97.79,7.6 99.06,6.33 IN3-4.3
E1  (via drill 0.61)
  Top 0.254: IC2.3 81.92,109.21 80.65,107.94 80.65,97.14 81.28,96.51 81.28,86.35 82.55,85.08 82.55,33.01 83.82,31.73 SV1.12 | v69.22,32.37 69.22,10.78 71.12,8.88 IN1-2.2
  Bottom 0.254: v69.22,32.37 81.92,32.37 83.19,31.1 SV1.12
E2  (via drill 0.61)
  Top 0.254: v116.2,95.87 113.66,93.33 113.66,46.34 113.03,45.7 113.03,26.65 | 113.03,26.65 113.03,20.3 111.76,19.04 SV2.8 | 113.03,26.65 105.41,19.04 105.41,15.22 102.87,12.68 102.87,7.6 101.6,6.33 IN3-4.5
  Bottom 0.254: v116.2,95.87 135.25,95.87 135.25,100.32 134.62,100.95 130.81,100.95 129.54,99.68 IC3.8
F1  (via drill 0.61)
  Top 0.254: IC2.6 83.19,101.59 86.36,98.41 86.36,86.35 85.09,85.08 85.09,33.01 86.36,31.73 SV1.14 | v77.47,12.68 v77.47,25.38
  Bottom 0.254: v77.47,12.68 73.66,8.88 IN1-2.4 | v77.47,25.38 80.01,27.92 80.01,29.83 84.45,29.83 85.72,31.1 SV1.14
F2
  Top 0.254: IC3.11 128.91,106.67 130.18,105.4 130.18,104.12 129.54,103.49 117.47,103.49 117.47,47.61 115.57,45.7 115.57,20.94 114.3,19.67 114.3,19.04 SV2.10 114.3,17.77 113.03,16.49 113.03,15.22 110.49,12.68 110.49,4.43 106.05,4.43 104.78,5.7 IN3-4.7
GND
  Top 0.508: SV2.7 111.12,15.86 109.86,15.86 SV2.5 | SV2.15 122.56,15.86 123.83,15.86 SV2.17 125.09,15.86 126.36,15.86 SV2.19 | SV2.25 133.99,15.86 132.72,15.86 SV2.23 | SV2.29 139.06,15.86 137.8,15.86 SV2.27 | SV2.33 144.14,15.86 142.88,15.86 SV2.31 | BYP7.2 125.09,76.82 125.09,60.95 123.83,59.68 IC7.7 123.19,58.41 123.19,34.91 121.92,33.64 T1GND.1 121.28,31.73 121.28,19.67 120.65,19.04 120.65,17.77 119.38,16.49 SV2.13 | IC4.7 133.99,99.05 134.62,98.41 134.62,92.7 BYP10.2 134.62,91.43 135.89,91.43 | 135.89,91.43 139.06,91.43 JP2.1 | IC1.7 70.48,100.32 71.75,101.59 71.75,117.46 BYP1.2 | 135.89,91.43 135.89,78.73 137.16,77.46 BYP8.2
  Bottom 0.508: SV2.1 104.78,15.86 106.05,15.86 SV2.3 107.31,15.86 108.59,15.86 SV2.5 | SV2.7 112.4,15.86 113.66,15.86 SV2.9 114.94,15.86 116.2,15.86 SV2.11 117.47,15.86 118.75,15.86 SV2.13 120.02,15.86 121.28,15.86 SV2.15 | SV2.19 127.64,15.86 128.91,15.86 SV2.21 130.18,15.86 131.44,15.86 SV2.23 | SV2.27 136.53,15.86 135.25,15.86 SV2.25 | SV2.31 141.61,15.86 140.34,15.86 SV2.29 | IC8.7 134.62,59.04 132.08,56.5 127,56.5 124.46,59.04 IC7.7 | BYP8.2 136.53,76.82 135.25,78.09 126.36,78.09 125.09,76.82 BYP7.2 | CORE-IO.11 78.11,81.9 76.2,83.81 CORE-IO.10 76.2,85.08 76.2,98.41 | 80.01,98.41 81.28,99.68 IC2.7 | 76.2,98.41 72.39,98.41 71.12,99.68 IC1.7 | 80.01,98.41 76.2,98.41 | 92.71,98.41 93.98,99.68 IC5.7 | 92.71,98.41 80.01,98.41 | 105.41,98.41 106.68,99.68 IC6.7 | 105.41,98.41 92.71,98.41 | 118.11,98.41 119.38,99.68 IC3.7 | 118.11,98.41 105.41,98.41 | 81.92,118.73 83.19,117.46 BYP2.2 | 81.92,118.73 73.03,118.73 71.75,117.46 BYP1.2 | 94.62,118.73 95.89,117.46 BYP3.2 | 81.92,118.73 94.62,118.73 | 107.31,118.73 108.59,117.46 BYP4.2 | 94.62,118.73 107.31,118.73 | 120.02,118.73 121.28,117.46 BYP5.2 | 107.31,118.73 120.02,118.73 | 120.02,118.73 132.72,118.73 133.99,117.46 BYP6.2 | 118.11,98.41 130.81,98.41 132.08,99.68 IC4.7
H1  (via drill 0.61)
  Top 0.254: IC2.8 90.81,99.05 91.44,98.41 91.44,34.27 88.9,31.73 SV1.16 | v79.38,23.48 79.38,12.05 76.2,8.88 IN1-2.6
  Bottom 0.254: v79.38,23.48 83.19,27.29 87,27.29 87.63,27.92 87.63,31.1 88.27,31.1 SV1.16
H2  (via drill 0.61)
  Top 0.254: v118.11,20.94 118.11,20.3 116.84,19.04 SV2.12
  Bottom 0.254: 110.49,22.21 110.49,20.3 97.16,20.3 96.52,19.67 96.52,8.88 IN3-4.2 | 110.49,22.21 110.49,85.08 120.65,95.23 135.89,95.23 135.89,97.14 139.7,100.95 142.88,100.95 142.88,102.86 142.24,103.49 139.7,103.49 133.99,109.21 IC4.3 | v118.11,20.94 116.84,22.21 110.49,22.21
J1
  Top 0.254: 87.63,30.46 87.63,85.08 88.9,86.35 88.9,96.51 88.27,97.14 88.27,105.4 89.53,106.67 IC2.11 | 87.63,30.46 88.27,29.83 93.34,29.83 93.34,31.1 SV1.20 | 87.63,30.46 87.63,29.83 83.19,29.83 82.55,29.2 82.55,27.92 80.65,26.02 80.65,10.78 78.74,8.88 IN1-2.8
J2  (via drill 0.61)
  Top 0.254: IC4.6 132.72,101.59 120.65,89.52 120.65,20.3 119.38,19.04 SV2.14 119.38,17.77 118.11,16.49 118.11,12.05 v116.84,10.78
  Bottom 0.254: v116.84,10.78 102.23,10.78 99.69,8.24 IN3-4.4
K1  (via drill 0.61)
  Top 0.254: IC5.3 94.62,109.21 93.34,107.94 93.34,97.14 93.98,96.51 93.98,78.09 92.08,76.19 92.08,31.1 SV1.18 | v82.55,20.3 82.55,7.6 81.28,6.33 IN1-2.9
  Bottom 0.254: v82.55,20.3 90.17,27.92 90.17,31.1 90.81,31.1 SV1.18
K2  (via drill 0.61)
  Top 0.254: v125.73,24.75 121.92,20.94 121.92,19.04 SV2.16 121.92,17.77 120.65,16.49 120.65,13.32 v116.84,9.51
  Bottom 0.254: v125.73,24.75 145.42,24.75 145.42,91.43 141.61,95.23 141.61,99.05 IC4.8 | v116.84,9.51 103.5,9.51 102.23,8.24 IN3-4.6
L1  (via drill 0.61)
  Top 0.254: IC5.6 95.89,101.59 97.16,100.32 97.16,97.14 96.52,96.51 96.52,78.09 97.79,76.82 97.79,33.01 99.06,31.73 SV1.24 | v90.81,6.97 101.6,17.77 v101.6,26.65
  Bottom 0.254: v90.81,6.97 85.72,6.97 84.45,5.7 IN1-2.11 | v101.6,26.65 102.87,27.92 102.87,32.37 100.97,32.37 99.69,31.1 SV1.24
L2  (via drill 0.61)
  Top 0.254: v125.73,23.48 124.46,22.21 124.46,19.04 SV2.18
  Bottom 0.254: 146.05,23.48 v125.73,23.48 | 146.05,23.48 147.95,23.48 147.95,100.32 141.61,106.67 IC4.11 | 146.05,23.48 146.05,10.14 138.43,2.53 105.41,2.53 105.41,6.33 104.14,7.6 IN3-4.8
M1  (via drill 0.61)
  Top 0.254: v106.05,100.95 106.05,97.14 106.68,96.51 106.68,78.09 105.41,76.82 105.41,33.01 104.14,31.73 SV1.28 | v87.63,17.13 87.63,7.6 86.36,6.33 IN1-2.13
  Bottom 0.254: v106.05,100.95 105.41,100.95 104.14,99.68 IC5.8 | v87.63,17.13 95.25,24.75 102.23,24.75 105.41,27.92 105.41,30.46 104.14,30.46 SV1.28
M2  (via drill 0.61)
  Top 0.254: v126.36,29.2 127,28.56 127,19.04 SV2.20 | v107.95,17.13 107.95,7.6 106.68,6.33 IN3-4.9
  Bottom 0.254: v126.36,29.2 120.65,29.2 120.65,68.57 121.28,68.57 121.92,69.2 IC7.3 | v107.95,17.13 125.09,17.13 126.36,18.4 SV2.20
N1  (via drill 0.61)
  Top 0.254: IC5.11 102.23,106.67 99.06,103.49 99.06,78.09 100.33,76.82 100.33,30.46 99.69,29.83 96.52,29.83 96.52,30.46 SV1.22 | v93.34,26.02 93.34,10.78 88.9,6.33 IN1-2.15
  Bottom 0.254: v93.34,26.02 95.25,27.92 95.25,31.1 95.89,31.1 SV1.22
N2  (via drill 0.61)
  Top 0.254: v127.64,57.77 128.27,57.13 128.27,20.3 | 128.27,20.3 129.54,19.04 SV2.22 | v120.02,6.97 128.27,6.97 128.27,20.3
  Bottom 0.254: v127.64,57.77 127,57.77 123.83,60.95 IC7.6 | v120.02,6.97 111.12,6.97 109.86,5.7 IN3-4.11
N$26
  Bottom 0.254: A5.L1 36.2,104.12 36.83,103.49 47.62,103.49 48.26,104.12 A9.L1
N$33
  Bottom 0.254: A5.L2 29.85,105.4 30.48,106.03 41.28,106.03 41.91,105.4 A9.L2
N$34
  Bottom 0.254: A5.M1 39.37,100.95 40.01,100.32 50.8,100.32 51.44,100.95 A9.M1
N$35
  Bottom 0.254: A5.M2 33.02,102.22 33.66,102.86 44.45,102.86 45.09,102.22 A9.M2
N$36
  Bottom 0.254: A5.N1 36.2,97.78 36.83,97.14 47.62,97.14 48.26,97.78 A9.N1
N$49
  Bottom 0.254: A5.N2 29.85,99.05 30.48,99.68 41.28,99.68 41.91,99.05 A9.N2
N$50
  Bottom 0.254: A5.P1 39.37,94.6 40.01,93.97 50.8,93.97 51.44,94.6 A9.P1
N$51
  Bottom 0.254: A5.P2 33.02,95.87 33.66,96.51 44.45,96.51 45.09,95.87 A9.P2
N$52
  Bottom 0.254: A5.R1 36.2,91.43 36.83,90.79 47.62,90.79 48.26,91.43 A9.R1
N$53
  Bottom 0.254: IC1.1 69.85,115.56 69.85,122.54 70.48,122.54 OUT1-2.1
N$54
  Bottom 0.254: IC1.4 70.48,107.94 71.75,109.21 71.75,113.65 68.58,113.65 67.95,114.29 67.95,123.81 71.75,123.81 73.03,122.54 OUT1-2.3
N$55
  Top 0.254: IC1.10 76.84,105.4 73.66,108.57 73.66,119.37 76.2,121.91 OUT1-2.5
N$56
  Top 0.254: IC1.13 76.84,113.02 74.93,114.92 74.93,118.1 78.74,121.91 OUT1-2.7
N$57
  Top 0.254: IC1.2 69.22,113.02 67.95,114.29 67.95,121.27 71.12,124.45 OUT1-2.2
N$58
  Top 0.254: IC1.5 69.22,105.4 67.31,107.3 67.31,123.18 70.48,126.35 73.66,126.35 73.66,125.72 OUT1-2.4
N$59
  Top 0.254: IC1.9 76.84,102.86 73.03,106.67 73.03,120 74.93,121.91 74.93,123.18 76.2,124.45 OUT1-2.6
N$60
  Top 0.254: IC1.12 76.84,110.48 74.3,113.02 74.3,118.73 77.47,121.91 77.47,123.18 78.74,124.45 OUT1-2.8
N$61  (via drill 0.61)
  Top 0.254: v124.46,109.21 124.46,121.91 OUT5-6.3
  Bottom 0.254: v124.46,109.21 123.83,109.21 121.92,107.3 IC3.4
N$62  (via drill 0.61)
  Top 0.254: v87,107.94 86.36,108.57 86.36,121.91 OUT1-2.13
  Bottom 0.254: v87,107.94 89.53,105.4 IC2.10
N$63
  Top 0.254: IC2.4 83.19,107.94 85.09,109.84 85.09,120.64 83.82,121.91 OUT1-2.11
N$64
  Top 0.254: IC2.1 81.92,115.56 81.28,116.19 81.28,121.91 OUT1-2.9
N$65
  Top 0.254: IC2.2 83.19,113.02 84.45,114.29 84.45,115.56 83.82,116.19 82.55,116.19 82.55,123.18 81.28,124.45 OUT1-2.10
N$66
  Top 0.254: IC2.5 83.19,105.4 85.72,107.94 85.72,121.27 85.09,121.91 85.09,123.18 83.82,124.45 OUT1-2.12
N$67  (via drill 0.61)
  Top 0.254: v80.65,113.65 80.01,114.29 80.01,125.72 80.65,126.35 86.36,126.35 86.36,125.72 OUT1-2.14
  Bottom 0.254: v80.65,113.65 84.45,113.65 84.45,107.94 89.53,102.86 IC2.9
N$68
  Top 0.254: IC2.12 90.81,110.48 92.71,112.38 92.71,120.64 88.9,124.45 OUT1-2.16
N$69
  Bottom 0.254: A5.R2 29.85,92.7 30.48,93.33 41.28,93.33 41.91,92.7 A9.R2
N$70
  Bottom 0.254: A5.S1 39.37,88.25 40.01,87.62 50.8,87.62 51.44,88.25 A9.S1
N$71
  Bottom 0.254: A5.S2 33.02,89.52 33.66,90.16 44.45,90.16 45.09,89.52 A9.S2
N$72
  Bottom 0.254: A5.T1 36.2,85.08 36.83,84.44 47.62,84.44 48.26,85.08 A9.T1
N$73
  Bottom 0.254: A5.T2 29.85,86.35 30.48,86.98 41.28,86.98 41.91,86.35 A9.T2
N$74
  Bottom 0.254: A5.U1 39.37,81.9 40.01,81.27 50.8,81.27 51.44,81.9 A9.U1
N$75
  Bottom 0.254: A5.U2 33.02,83.17 33.66,83.81 44.45,83.81 45.09,83.17 A9.U2
N$76
  Bottom 0.254: A5.V1 36.2,78.73 36.83,78.09 47.62,78.09 48.26,78.73 A9.V1
N$81
  Bottom 0.254: A5.V2 29.85,80 30.48,80.63 41.28,80.63 41.91,80 A9.V2
N$82
  Bottom 0.254: A5.A1 39.37,132.7 40.01,132.06 50.8,132.06 51.44,132.7 A9.A1
N$83
  Bottom 0.254: A5.A2 33.02,133.97 33.66,134.6 44.45,134.6 45.09,133.97 A9.A2
N$84
  Bottom 0.254: A5.B1 36.2,129.53 36.83,128.89 47.62,128.89 48.26,129.53 A9.B1
N$85
  Bottom 0.254: A5.B2 29.85,130.79 30.48,131.43 41.28,131.43 41.91,130.79 A9.B2
N$86
  Bottom 0.254: A5.C1 39.37,126.35 40.01,125.72 50.8,125.72 51.44,126.35 A9.C1
N$87
  Bottom 0.254: A5.C2 33.02,127.62 33.66,128.25 44.45,128.25 45.09,127.62 A9.C2
N$88
  Bottom 0.254: A5.D1 36.2,123.18 36.83,122.54 47.62,122.54 48.26,123.18 A9.D1
N$89
  Bottom 0.254: A5.D2 29.85,124.45 30.48,125.08 41.28,125.08 41.91,124.45 A9.D2
N$90
  Bottom 0.254: A5.E1 39.37,120 40.01,119.37 50.8,119.37 51.44,120 A9.E1
N$91
  Bottom 0.254: A5.E2 33.02,121.27 33.66,121.91 44.45,121.91 45.09,121.27 A9.E2
N$92
  Bottom 0.254: A5.F1 36.2,116.83 36.83,116.19 47.62,116.19 48.26,116.83 A9.F1
N$93
  Bottom 0.254: A5.F2 29.85,118.1 30.48,118.73 41.28,118.73 41.91,118.1 A9.F2
N$95
  Bottom 0.254: A5.H1 39.37,113.65 40.01,113.02 50.8,113.02 51.44,113.65 A9.H1
N$96
  Bottom 0.254: A5.H2 33.02,114.92 33.66,115.56 44.45,115.56 45.09,114.92 A9.H2
N$97
  Bottom 0.254: A5.J1 36.2,110.48 36.83,109.84 47.62,109.84 48.26,110.48 A9.J1
N$98
  Bottom 0.254: A5.J2 29.85,111.75 30.48,112.38 41.28,112.38 41.91,111.75 A9.J2
N$99
  Bottom 0.254: A5.K1 39.37,107.3 40.01,106.67 50.8,106.67 51.44,107.3 A9.K1
N$100
  Bottom 0.254: A5.K2 33.02,108.57 33.66,109.21 44.45,109.21 45.09,108.57 A9.K2
N$113
  Bottom 0.254: A6.L1 10.8,104.12 11.43,103.49 22.23,103.49 22.86,104.12 A7.L1
N$114
  Bottom 0.254: A6.L2 4.45,105.4 5.08,106.03 15.88,106.03 16.51,105.4 A7.L2
N$115
  Bottom 0.254: A6.M1 13.97,100.95 14.61,100.32 25.4,100.32 26.04,100.95 A7.M1
N$116
  Bottom 0.254: A6.M2 7.62,102.22 8.26,102.86 19.05,102.86 19.69,102.22 A7.M2
N$117
  Bottom 0.254: A6.N1 10.8,97.78 11.43,97.14 22.23,97.14 22.86,97.78 A7.N1
N$118
  Bottom 0.254: A6.N2 4.45,99.05 5.08,99.68 15.88,99.68 16.51,99.05 A7.N2
N$119
  Bottom 0.254: A6.P1 13.97,94.6 14.61,93.97 25.4,93.97 26.04,94.6 A7.P1
N$120
  Bottom 0.254: A6.P2 7.62,95.87 8.26,96.51 19.05,96.51 19.69,95.87 A7.P2
N$121
  Bottom 0.254: A6.R1 10.8,91.43 11.43,90.79 22.23,90.79 22.86,91.43 A7.R1
N$122
  Bottom 0.254: A6.R2 4.45,92.7 5.08,93.33 15.88,93.33 16.51,92.7 A7.R2
N$123
  Bottom 0.254: A6.S1 13.97,88.25 14.61,87.62 25.4,87.62 26.04,88.25 A7.S1
N$137
  Bottom 0.254: A6.S2 7.62,89.52 8.26,90.16 19.05,90.16 19.69,89.52 A7.S2
N$138
  Top 0.254: IC3.13 128.91,113.02 130.18,114.29 130.18,122.54 OUT5-6.7
N$139
  Top 0.254: IC2.13 90.81,113.02 92.08,114.29 92.08,118.73 88.9,121.91 OUT1-2.15
N$140
  Top 0.254: IC3.2 120.02,113.02 118.75,114.29 118.75,121.27 121.92,124.45 OUT5-6.2
N$141
  Top 0.254: IC3.5 121.92,104.76 123.19,104.76 123.19,123.18 124.46,124.45 OUT5-6.4
N$142
  Top 0.254: IC3.9 129.54,102.22 131.44,102.22 131.44,102.86 132.08,103.49 136.53,103.49 136.53,121.27 135.89,121.91 135.89,125.72 135.25,126.35 127,126.35 127,125.72 OUT5-6.6
N$143
  Top 0.254: IC3.12 127,109.84 125.09,109.84 125.09,121.27 125.73,121.91 125.73,123.18 126.36,123.81 128.91,123.81 128.91,125.08 OUT5-6.8
N$144
  Top 0.254: IC4.10 140.34,105.4 137.16,108.57 137.16,121.91 OUT5-6.13
N$145
  Top 0.254: IC4.4 133.99,107.94 135.89,109.84 135.89,120.64 134.62,121.91 OUT5-6.11
N$146
  Top 0.254: IC4.1 132.72,115.56 132.08,116.19 132.08,121.91 OUT5-6.9
N$147
  Top 0.254: IC4.2 132.72,113.02 130.81,114.92 130.81,123.18 132.08,124.45 OUT5-6.10
N$148
  Bottom 0.254: IC4.9 139.7,102.22 135.89,106.03 132.08,106.03 131.44,106.67 131.44,113.65 137.16,113.65 139.7,116.19 140.34,116.19 140.97,116.83 140.97,123.81 139.06,123.81 137.8,125.08 OUT5-6.14
N$149
  Bottom 0.254: IC4.12 141.61,110.48 142.88,111.75 142.88,124.45 139.7,124.45 OUT5-6.16
N$150
  Top 0.254: IC3.1 120.65,115.56 120.65,120.64 121.92,121.91 OUT5-6.1
N$151
  Top 0.254: IC3.10 127.64,105.4 126.36,106.67 126.36,107.94 127,108.57 130.18,108.57 130.18,110.48 129.54,111.11 125.73,111.11 125.73,120.64 127,121.91 OUT5-6.5
N$152
  Top 0.254: IC4.5 132.72,105.4 131.44,106.67 131.44,110.48 132.08,111.11 135.25,111.11 135.25,115.56 134.62,116.19 133.35,116.19 133.35,123.18 134.62,124.45 OUT5-6.12
N$153
  Top 0.254: IC4.13 140.34,113.02 138.43,114.92 138.43,120.64 139.7,121.91 OUT5-6.15
N$154  (via drill 0.61)
  Top 0.254: v99.06,109.21 99.06,121.91 OUT3-4.3
  Bottom 0.254: v99.06,109.21 98.43,109.21 96.52,107.3 IC5.4
N$155
  Top 0.254: IC5.13 103.5,113.02 104.78,114.29 104.78,122.54 OUT3-4.7
N$156
  Top 0.254: IC5.2 94.62,113.02 93.34,114.29 93.34,121.27 96.52,124.45 OUT3-4.2
N$157
  Top 0.254: IC5.5 95.89,105.4 97.16,106.67 97.16,110.48 96.52,111.11 92.71,111.11 92.71,109.84 91.44,108.57 87.63,108.57 87.63,125.72 88.27,126.35 99.06,126.35 99.06,125.72 OUT3-4.4
N$158
  Top 0.254: IC5.9 103.5,102.86 104.78,104.12 104.78,110.48 104.14,111.11 100.33,111.11 100.33,119.37 102.87,121.91 102.87,123.18 101.6,124.45 OUT3-4.6
N$159
  Top 0.254: IC5.12 101.6,109.84 99.69,109.84 99.69,121.27 100.33,121.91 100.33,125.72 100.97,126.35 104.14,126.35 104.14,125.72 OUT3-4.8
N$160
  Top 0.254: IC6.10 116.84,104.76 118.75,104.76 118.75,105.4 119.38,106.03 122.56,106.03 122.56,110.48 121.92,111.11 118.11,111.11 118.11,109.84 116.84,108.57 111.76,108.57 111.76,121.91 OUT3-4.13
N$161
  Top 0.254: IC6.4 108.59,107.94 110.49,109.84 110.49,120.64 109.22,121.91 OUT3-4.11
N$162
  Top 0.254: IC6.1 107.31,115.56 106.68,116.19 106.68,121.91 OUT3-4.9
N$163
  Top 0.254: IC6.2 107.31,113.02 105.41,114.92 105.41,123.18 106.68,124.45 OUT3-4.10
N$164  (via drill 0.61)
  Top 0.254: v113.66,111.11 112.4,112.38 112.4,121.27 113.03,121.91 113.03,123.18 111.76,124.45 OUT3-4.14
  Bottom 0.254: v113.66,111.11 117.47,111.11 117.47,104.12 116.2,102.86 IC6.9
N$165
  Top 0.254: IC6.12 116.2,110.48 117.47,111.75 117.47,121.27 114.3,124.45 OUT3-4.16
N$166
  Top 0.254: IC5.1 95.25,115.56 95.25,120.64 96.52,121.91 OUT3-4.1
N$167  (via drill 0.61)
  Top 0.254: v99.06,107.94 97.79,109.21 v97.79,120
  Bottom 0.254: v99.06,107.94 99.69,107.94 102.23,105.4 IC5.10 | v97.79,120 99.06,121.27 99.69,121.27 100.97,122.54 OUT3-4.5
N$168
  Top 0.254: IC6.5 108.59,105.4 111.12,107.94 111.12,121.27 110.49,121.91 110.49,123.18 109.22,124.45 OUT3-4.12
N$169
  Top 0.254: IC6.13 114.94,113.02 113.03,114.92 113.03,120.64 114.3,121.91 OUT3-4.15
N$170  (via drill 0.61)
  Top 0.254: v127.64,69.84 127.64,81.9 OUT7-8.3
  Bottom 0.254: v127.64,69.84 124.46,66.66 IC7.4
N$171
  Top 0.254: IC7.13 131.44,72.38 132.72,73.65 132.72,81.9 OUT7-8.7
N$172  (via drill 0.61)
  Top 0.254: v126.36,74.28 125.73,74.92 125.73,82.54 124.46,83.81 OUT7-8.2
  Bottom 0.254: v126.36,74.28 125.73,74.28 123.83,72.38 IC7.2
N$173
  Top 0.254: IC7.5 122.56,64.76 121.28,66.03 121.28,83.17 123.83,85.71 127,85.71 127,85.08 OUT7-8.4
N$174
  Bottom 0.254: IC7.9 129.54,61.58 125.73,65.39 121.92,65.39 121.28,66.03 121.28,67.93 124.46,67.93 125.09,68.57 125.09,70.47 121.92,70.47 121.28,71.11 121.28,83.17 127.64,83.17 128.91,84.44 OUT7-8.6
N$175
  Top 0.254: IC7.12 130.18,69.84 128.27,71.74 128.27,78.73 130.81,81.27 130.81,82.54 132.08,83.81 OUT7-8.8
N$176
  Top 0.254: IC8.10 142.88,64.76 141.61,66.03 141.61,67.3 142.24,67.93 146.05,67.93 146.05,82.54 142.88,85.71 138.43,85.71 138.43,83.81 139.7,82.54 OUT7-8.13
N$177
  Top 0.254: IC8.4 136.53,67.3 138.43,69.2 138.43,80 137.16,81.27 OUT7-8.11
N$178
  Top 0.254: IC8.1 135.25,74.92 134.62,75.55 134.62,81.27 OUT7-8.9
N$179
  Top 0.254: IC8.2 135.25,72.38 133.35,74.28 133.35,82.54 134.62,83.81 OUT7-8.10
N$180
  Top 0.254: IC8.9 142.88,62.21 140.34,64.76 140.34,80.63 140.97,81.27 140.97,82.54 139.7,83.81 OUT7-8.14
N$181
  Top 0.254: IC8.12 144.14,69.84 145.42,71.11 145.42,80.63 142.24,83.81 OUT7-8.16
N$182
  Bottom 0.254: IC7.1 122.56,74.92 122.56,81.9 123.83,81.9 OUT7-8.1
N$183
  Bottom 0.254: IC7.10 130.18,64.76 128.91,66.03 128.91,75.55 123.83,75.55 123.19,76.19 123.19,80.63 127.64,80.63 128.91,81.9 OUT7-8.5
N$184
  Top 0.254: IC8.5 136.53,64.76 139.06,67.3 139.06,80.63 138.43,81.27 138.43,82.54 137.16,83.81 OUT7-8.12
N$185
  Top 0.254: IC8.13 142.88,72.38 140.97,74.28 140.97,80 142.24,81.27 OUT7-8.15
N$186
  Bottom 0.254: A6.T1 10.8,85.08 11.43,84.44 22.23,84.44 22.86,85.08 A7.T1
N$187
  Bottom 0.254: A6.T2 4.45,86.35 5.08,86.98 15.88,86.98 16.51,86.35 A7.T2
N$188
  Bottom 0.254: A6.U1 13.97,81.9 14.61,81.27 25.4,81.27 26.04,81.9 A7.U1
N$189
  Bottom 0.254: A6.U2 7.62,83.17 8.26,83.81 19.05,83.81 19.69,83.17 A7.U2
N$190
  Bottom 0.254: A6.V1 10.8,78.73 11.43,78.09 22.23,78.09 22.86,78.73 A7.V1
N$191
  Bottom 0.254: A6.V2 4.45,80 5.08,80.63 15.88,80.63 16.51,80 A7.V2
N$192
  Bottom 0.254: A6.A1 13.97,132.7 14.61,132.06 25.4,132.06 26.04,132.7 A7.A1
N$193
  Bottom 0.254: A6.A2 7.62,133.97 8.26,134.6 19.05,134.6 19.69,133.97 A7.A2
N$194
  Bottom 0.254: A6.B1 10.8,129.53 11.43,128.89 22.23,128.89 22.86,129.53 A7.B1
N$195
  Bottom 0.254: A6.B2 4.45,130.79 5.08,131.43 15.88,131.43 16.51,130.79 A7.B2
N$196
  Bottom 0.254: A6.C1 13.97,126.35 14.61,125.72 25.4,125.72 26.04,126.35 A7.C1
N$197
  Bottom 0.254: A6.C2 7.62,127.62 8.26,128.25 19.05,128.25 19.69,127.62 A7.C2
N$198
  Bottom 0.254: A6.D1 10.8,123.18 11.43,122.54 22.23,122.54 22.86,123.18 A7.D1
N$199
  Bottom 0.254: A6.D2 4.45,124.45 5.08,125.08 15.88,125.08 16.51,124.45 A7.D2
N$200
  Bottom 0.254: A6.E1 13.97,120 14.61,119.37 25.4,119.37 26.04,120 A7.E1
N$201
  Bottom 0.254: A6.E2 7.62,121.27 8.26,121.91 19.05,121.91 19.69,121.27 A7.E2
N$202
  Bottom 0.254: A6.F1 10.8,116.83 11.43,116.19 22.23,116.19 22.86,116.83 A7.F1
N$203
  Bottom 0.254: A6.F2 4.45,118.1 5.08,118.73 15.88,118.73 16.51,118.1 A7.F2
N$204
  Bottom 0.254: A6.H1 13.97,113.65 14.61,113.02 25.4,113.02 26.04,113.65 A7.H1
N$205
  Bottom 0.254: A6.H2 7.62,114.92 8.26,115.56 19.05,115.56 19.69,114.92 A7.H2
N$206
  Bottom 0.254: A6.J1 10.8,110.48 11.43,109.84 22.23,109.84 22.86,110.48 A7.J1
N$207
  Bottom 0.254: A6.J2 4.45,111.75 5.08,112.38 15.88,112.38 16.51,111.75 A7.J2
N$208
  Bottom 0.254: A6.K1 13.97,107.3 14.61,106.67 25.4,106.67 26.04,107.3 A7.K1
N$209
  Bottom 0.254: A6.K2 7.62,108.57 8.26,109.21 19.05,109.21 19.69,108.57 A7.K2
N$210
  Bottom 0.254: A8.L1 10.8,34.27 11.43,33.64 22.23,33.64 22.86,34.27 A10.L1
N$211
  Bottom 0.254: A8.L2 4.45,35.55 5.08,36.18 15.88,36.18 16.51,35.55 A10.L2
N$212
  Bottom 0.254: A8.M1 13.97,31.1 14.61,30.46 25.4,30.46 26.04,31.1 A10.M1
N$213
  Bottom 0.254: A8.M2 7.62,32.37 8.26,33.01 19.05,33.01 19.69,32.37 A10.M2
N$214
  Bottom 0.254: A8.N1 10.8,27.92 11.43,27.29 22.23,27.29 22.86,27.92 A10.N1
N$215
  Bottom 0.254: A8.N2 4.45,29.2 5.08,29.83 15.88,29.83 16.51,29.2 A10.N2
N$216
  Bottom 0.254: A8.P1 13.97,24.75 14.61,24.11 25.4,24.11 26.04,24.75 A10.P1
N$217
  Bottom 0.254: A8.P2 7.62,26.02 8.26,26.65 19.05,26.65 19.69,26.02 A10.P2
N$218
  Bottom 0.254: A8.R1 10.8,21.57 11.43,20.94 22.23,20.94 22.86,21.57 A10.R1
N$219
  Bottom 0.254: A8.R2 4.45,22.84 5.08,23.48 15.88,23.48 16.51,22.84 A10.R2
N$220
  Bottom 0.254: A8.S1 13.97,18.4 14.61,17.77 25.4,17.77 26.04,18.4 A10.S1
N$221
  Bottom 0.254: A8.S2 7.62,19.67 8.26,20.3 19.05,20.3 19.69,19.67 A10.S2
N$222
  Bottom 0.254: A8.T1 10.8,15.22 11.43,14.59 22.23,14.59 22.86,15.22 A10.T1
N$223
  Bottom 0.254: A8.T2 4.45,16.49 5.08,17.13 15.88,17.13 16.51,16.49 A10.T2
N$224
  Bottom 0.254: A8.U1 13.97,12.05 14.61,11.41 25.4,11.41 26.04,12.05 A10.U1
N$225
  Bottom 0.254: A8.U2 7.62,13.32 8.26,13.95 19.05,13.95 19.69,13.32 A10.U2
N$226
  Bottom 0.254: A8.V1 10.8,8.88 11.43,8.24 22.23,8.24 22.86,8.88 A10.V1
N$227
  Bottom 0.254: A8.V2 4.45,10.14 5.08,10.78 15.88,10.78 16.51,10.14 A10.V2
N$228
  Bottom 0.254: A8.A1 13.97,62.85 14.61,62.21 25.4,62.21 26.04,62.85 A10.A1
N$229
  Bottom 0.254: A8.A2 7.62,64.12 8.26,64.76 19.05,64.76 19.69,64.12 A10.A2
N$230
  Bottom 0.254: A8.B1 10.8,59.68 11.43,59.04 22.23,59.04 22.86,59.68 A10.B1
N$231
  Bottom 0.254: A8.B2 4.45,60.95 5.08,61.58 15.88,61.58 16.51,60.95 A10.B2
N$232
  Bottom 0.254: A8.C1 13.97,56.5 14.61,55.87 25.4,55.87 26.04,56.5 A10.C1
N$233
  Bottom 0.254: A8.C2 7.62,57.77 8.26,58.41 19.05,58.41 19.69,57.77 A10.C2
N$234
  Bottom 0.254: A8.D1 10.8,53.32 11.43,52.69 22.23,52.69 22.86,53.32 A10.D1
N$235
  Bottom 0.254: A8.D2 4.45,54.59 5.08,55.23 15.88,55.23 16.51,54.59 A10.D2
N$236
  Bottom 0.254: A8.E1 13.97,50.15 14.61,49.52 25.4,49.52 26.04,50.15 A10.E1
N$237
  Bottom 0.254: A8.E2 7.62,51.42 8.26,52.05 19.05,52.05 19.69,51.42 A10.E2
N$238
  Bottom 0.254: A8.F1 10.8,46.98 11.43,46.34 22.23,46.34 22.86,46.98 A10.F1
N$239
  Bottom 0.254: A8.F2 4.45,48.24 5.08,48.88 15.88,48.88 16.51,48.24 A10.F2
N$240
  Bottom 0.254: A8.H1 13.97,43.8 14.61,43.16 25.4,43.16 26.04,43.8 A10.H1
N$241
  Bottom 0.254: A8.H2 7.62,45.07 8.26,45.7 19.05,45.7 19.69,45.07 A10.H2
N$242
  Bottom 0.254: A8.J1 10.8,40.62 11.43,39.99 22.23,39.99 22.86,40.62 A10.J1
N$243
  Bottom 0.254: A8.J2 4.45,41.89 5.08,42.53 15.88,42.53 16.51,41.89 A10.J2
N$244
  Bottom 0.254: A8.K1 13.97,37.45 14.61,36.81 25.4,36.81 26.04,37.45 A10.K1
N$245
  Bottom 0.254: A8.K2 7.62,38.72 8.26,39.35 19.05,39.35 19.69,38.72 A10.K2
N$246
  Bottom 0.254: A11.L1 36.2,34.27 36.83,33.64 47.62,33.64 48.26,34.27 A12.L1
N$247
  Bottom 0.254: A11.L2 29.85,35.55 30.48,36.18 41.28,36.18 41.91,35.55 A12.L2
N$248
  Bottom 0.254: A11.M1 39.37,31.1 40.01,30.46 50.8,30.46 51.44,31.1 A12.M1
N$249
  Bottom 0.254: A11.M2 33.02,32.37 33.66,33.01 44.45,33.01 45.09,32.37 A12.M2
N$250
  Bottom 0.254: A11.N1 36.2,27.92 36.83,27.29 47.62,27.29 48.26,27.92 A12.N1
N$251
  Bottom 0.254: A11.N2 29.85,29.2 30.48,29.83 41.28,29.83 41.91,29.2 A12.N2
N$252
  Bottom 0.254: A11.P1 39.37,24.75 40.01,24.11 50.8,24.11 51.44,24.75 A12.P1
N$253
  Bottom 0.254: A11.P2 33.02,26.02 33.66,26.65 44.45,26.65 45.09,26.02 A12.P2
N$254
  Bottom 0.254: A11.R1 36.2,21.57 36.83,20.94 47.62,20.94 48.26,21.57 A12.R1
N$255
  Bottom 0.254: A11.R2 29.85,22.84 30.48,23.48 41.28,23.48 41.91,22.84 A12.R2
N$256
  Bottom 0.254: A11.S1 39.37,18.4 40.01,17.77 50.8,17.77 51.44,18.4 A12.S1
N$257
  Bottom 0.254: A11.S2 33.02,19.67 33.66,20.3 44.45,20.3 45.09,19.67 A12.S2
N$258
  Bottom 0.254: A11.T1 36.2,15.22 36.83,14.59 47.62,14.59 48.26,15.22 A12.T1
N$259
  Bottom 0.254: A11.T2 29.85,16.49 30.48,17.13 41.28,17.13 41.91,16.49 A12.T2
N$260
  Bottom 0.254: A11.U1 39.37,12.05 40.01,11.41 50.8,11.41 51.44,12.05 A12.U1
N$261
  Bottom 0.254: A11.U2 33.02,13.32 33.66,13.95 44.45,13.95 45.09,13.32 A12.U2
N$262
  Bottom 0.254: A11.V1 36.2,8.88 36.83,8.24 47.62,8.24 48.26,8.88 A12.V1
N$263
  Bottom 0.254: A11.V2 29.85,10.14 30.48,10.78 41.28,10.78 41.91,10.14 A12.V2
N$264
  Bottom 0.254: A11.A1 39.37,62.85 40.01,62.21 50.8,62.21 51.44,62.85 A12.A1
N$265
  Bottom 0.254: A11.A2 33.02,64.12 33.66,64.76 44.45,64.76 45.09,64.12 A12.A2
N$266
  Bottom 0.254: A11.B1 36.2,59.68 36.83,59.04 47.62,59.04 48.26,59.68 A12.B1
N$267
  Bottom 0.254: A11.B2 29.85,60.95 30.48,61.58 41.28,61.58 41.91,60.95 A12.B2
N$268
  Bottom 0.254: A11.C1 39.37,56.5 40.01,55.87 50.8,55.87 51.44,56.5 A12.C1
N$269
  Bottom 0.254: A11.C2 33.02,57.77 33.66,58.41 44.45,58.41 45.09,57.77 A12.C2
N$270
  Bottom 0.254: A11.D1 36.2,53.32 36.83,52.69 47.62,52.69 48.26,53.32 A12.D1
N$271
  Bottom 0.254: A11.D2 29.85,54.59 30.48,55.23 41.28,55.23 41.91,54.59 A12.D2
N$272
  Bottom 0.254: A11.E1 39.37,50.15 40.01,49.52 50.8,49.52 51.44,50.15 A12.E1
N$273
  Bottom 0.254: A11.E2 33.02,51.42 33.66,52.05 44.45,52.05 45.09,51.42 A12.E2
N$274
  Bottom 0.254: A11.F1 36.2,46.98 36.83,46.34 47.62,46.34 48.26,46.98 A12.F1
N$275
  Bottom 0.254: A11.F2 29.85,48.24 30.48,48.88 41.28,48.88 41.91,48.24 A12.F2
N$276
  Bottom 0.254: A11.H1 39.37,43.8 40.01,43.16 50.8,43.16 51.44,43.8 A12.H1
N$277
  Bottom 0.254: A11.H2 33.02,45.07 33.66,45.7 44.45,45.7 45.09,45.07 A12.H2
N$278
  Bottom 0.254: A11.J1 36.2,40.62 36.83,39.99 47.62,39.99 48.26,40.62 A12.J1
N$279
  Bottom 0.254: A11.J2 29.85,41.89 30.48,42.53 41.28,42.53 41.91,41.89 A12.J2
N$280
  Bottom 0.254: A11.K1 39.37,37.45 40.01,36.81 50.8,36.81 51.44,37.45 A12.K1
N$281
  Bottom 0.254: A11.K2 33.02,38.72 33.66,39.35 44.45,39.35 45.09,38.72 A12.K2
P1
  Top 0.254: IC6.3 107.31,109.21 106.05,107.94 106.05,104.12 106.68,103.49 109.86,103.49 109.86,97.14 109.22,96.51 109.22,78.09 107.95,76.82 107.95,33.01 106.68,31.73 SV1.30 106.05,31.1 106.05,29.83 100.97,29.83 100.33,29.2 100.33,27.29 88.27,27.29 81.28,20.3 81.28,8.88 IN1-2.10
P2  (via drill 0.61)
  Top 0.254: 130.81,20.3 130.81,58.41 IC7.8 | 130.81,20.3 132.08,19.04 SV2.24 | v130.81,6.97 130.81,20.3
  Bottom 0.254: v130.81,6.97 121.28,6.97 118.75,4.43 113.66,4.43 112.4,5.7 IN3-4.13
R1  (via drill 0.61)
  Top 0.254: IC6.6 106.68,102.22 104.78,102.22 104.78,97.14 104.14,96.51 104.14,78.09 102.87,76.82 102.87,33.01 101.6,31.73 SV1.26 | v86.36,17.13 86.36,11.41 83.82,8.88 IN1-2.12
  Bottom 0.254: v86.36,17.13 96.52,27.29 97.16,27.29 97.79,27.92 97.79,29.83 99.69,29.83 100.97,31.1 SV1.26
R2  (via drill 0.61)
  Top 0.254: IC7.11 131.44,66.03 133.35,64.12 133.35,20.3 134.62,19.04 SV2.26 | v115.57,19.67 115.57,7.6 114.3,6.33 IN3-4.15
  Bottom 0.254: v115.57,19.67 132.72,19.67 133.99,18.4 SV2.26
S1
  Top 0.254: IC6.8 114.94,99.05 113.03,97.14 113.03,48.24 110.49,45.7 110.49,33.01 109.22,31.73 SV1.32
  Bottom 0.254: IN1-2.14 85.72,8.24 84.45,6.97 83.19,6.97 82.55,6.33 82.55,4.43 97.16,4.43 97.79,5.07 97.79,6.33 97.16,6.97 95.89,6.97 95.25,7.6 95.25,23.48 103.5,23.48 107.95,27.92 107.95,31.1 108.59,31.1 SV1.32
S2  (via drill 0.61)
  Top 0.254: 135.89,20.3 135.89,45.7 133.99,47.61 133.99,67.3 135.25,68.57 IC8.3 | 135.89,20.3 137.16,19.04 SV2.28 | v134.62,3.8 135.89,5.07 135.89,20.3
  Bottom 0.254: v134.62,3.8 107.95,3.8 107.95,6.33 106.68,7.6 IN3-4.10
T1
  Bottom 0.254: T1GND.2 118.75,31.73 118.11,31.1 112.4,31.1 SV1.34
T2  (via drill 0.61)
  Top 0.254: IC8.6 136.53,60.95 138.43,59.04 138.43,20.3 139.7,19.04 SV2.30 | v109.22,12.05 109.22,8.88 IN3-4.12
  Bottom 0.254: v109.22,12.05 111.76,14.59 132.72,14.59 133.35,15.22 133.35,17.13 137.8,17.13 139.06,18.4 SV2.30
U1  (via drill 0.61)
  Top 0.254: v76.2,21.57 75.56,22.21 75.56,27.29 74.93,27.92 74.93,29.2 73.66,30.46 SV1.4
  Bottom 0.254: IC6.11 114.3,107.3 110.49,103.49 93.98,103.49 91.44,100.95 68.58,100.95 63.5,95.87 63.5,29.83 71.75,29.83 73.03,31.1 SV1.4 | v76.2,21.57 88.9,8.88 IN1-2.16
U2  (via drill 0.61)
  Top 0.254: v144.14,22.21 144.14,58.41 IC8.8 | v114.3,12.05 114.3,11.41 111.76,8.88 IN3-4.14
  Bottom 0.254: v144.14,22.21 144.14,19.04 144.78,19.04 SV2.34 144.14,18.4 143.51,18.4 143.51,15.22 141.61,13.32 115.57,13.32 v114.3,12.05
V1  (via drill 0.61)
  Top 0.254: v111.76,87.62 111.76,106.03 116.84,106.03 120.02,109.21 IC3.3 | v71.12,24.75 69.85,26.02 69.85,29.2 71.12,30.46 SV1.2
  Bottom 0.254: v111.76,87.62 102.87,78.73 102.87,34.91 65.41,34.91 64.14,33.64 64.14,31.1 70.48,31.1 SV1.2 | v71.12,24.75 76.84,24.75 95.89,5.7 IN3-4.1
V2  (via drill 0.61)
  Top 0.254: IC8.11 144.14,66.03 145.42,64.76 145.42,22.21 142.24,19.04 SV2.32 142.24,17.77 140.97,16.49 140.97,15.22 v137.8,12.05
  Bottom 0.254: v137.8,12.05 123.83,12.05 120.02,8.24 114.94,8.24 IN3-4.16
VCC  (via drill 0.61)
  Top 0.508: IC7.14 130.18,74.92 129.54,75.55 129.54,76.19 BYP7.1 | IC8.14 142.88,74.92 142.24,75.55 142.24,76.19 BYP8.1 | v111.76,26.65 104.14,19.04 SV2.2 | BYP6.1 139.7,116.83 139.7,116.19 140.34,115.56 IC4.14 141.61,114.29 142.88,113.02 142.88,93.97 142.24,93.33 JP2.2 | CORE-IO.9 76.84,81.9 78.74,83.81 CORE-IO.12 78.74,85.08 78.74,98.41 79.38,99.05 79.38,113.02 78.11,114.29 IC1.14 76.84,115.56 76.2,116.19 76.2,116.83 BYP1.1 | IC3.14 127.64,115.56 127,116.19 127,116.83 BYP5.1 | IC6.14 114.94,115.56 114.3,116.19 114.3,116.83 BYP4.1 | IC5.14 102.23,115.56 101.6,116.19 101.6,116.83 BYP3.1 | IC2.14 89.53,115.56 88.9,116.19 88.9,116.83 BYP2.1
  Bottom 0.508: v111.76,26.65 113.03,27.92 132.08,27.92 140.97,36.81 140.97,73.01 | 140.97,73.01 140.97,74.28 142.24,74.28 IC8.14 | 140.97,73.01 133.35,73.01 132.08,74.28 IC7.14 | 138.43,94.6 140.97,94.6 142.24,93.33 JP2.2 | 138.43,94.6 122.56,94.6 120.02,92.06 BYP10.1 | 87,116.19 80.01,116.19 78.74,114.92 IC1.14 | 87,116.19 88.27,117.46 BYP2.1 | 99.69,116.19 100.97,117.46 BYP3.1 | 99.69,116.19 87,116.19 | 112.4,116.19 113.66,117.46 BYP4.1 | 112.4,116.19 99.69,116.19 | 125.09,116.19 126.36,117.46 BYP5.1 | 125.09,116.19 112.4,116.19 | 125.09,116.19 137.8,116.19 139.06,117.46 BYP6.1 | 138.43,94.6 138.43,81.27 142.24,77.46 BYP8.1

### Text on the board
Top: Component Side | PA8PDP/VRS
Bottom: Solder Side
tValues: - | + | + | - | FlipChip Tester - Rev.1